# Altium project higgs.PrjPCB (part 1 of 7)
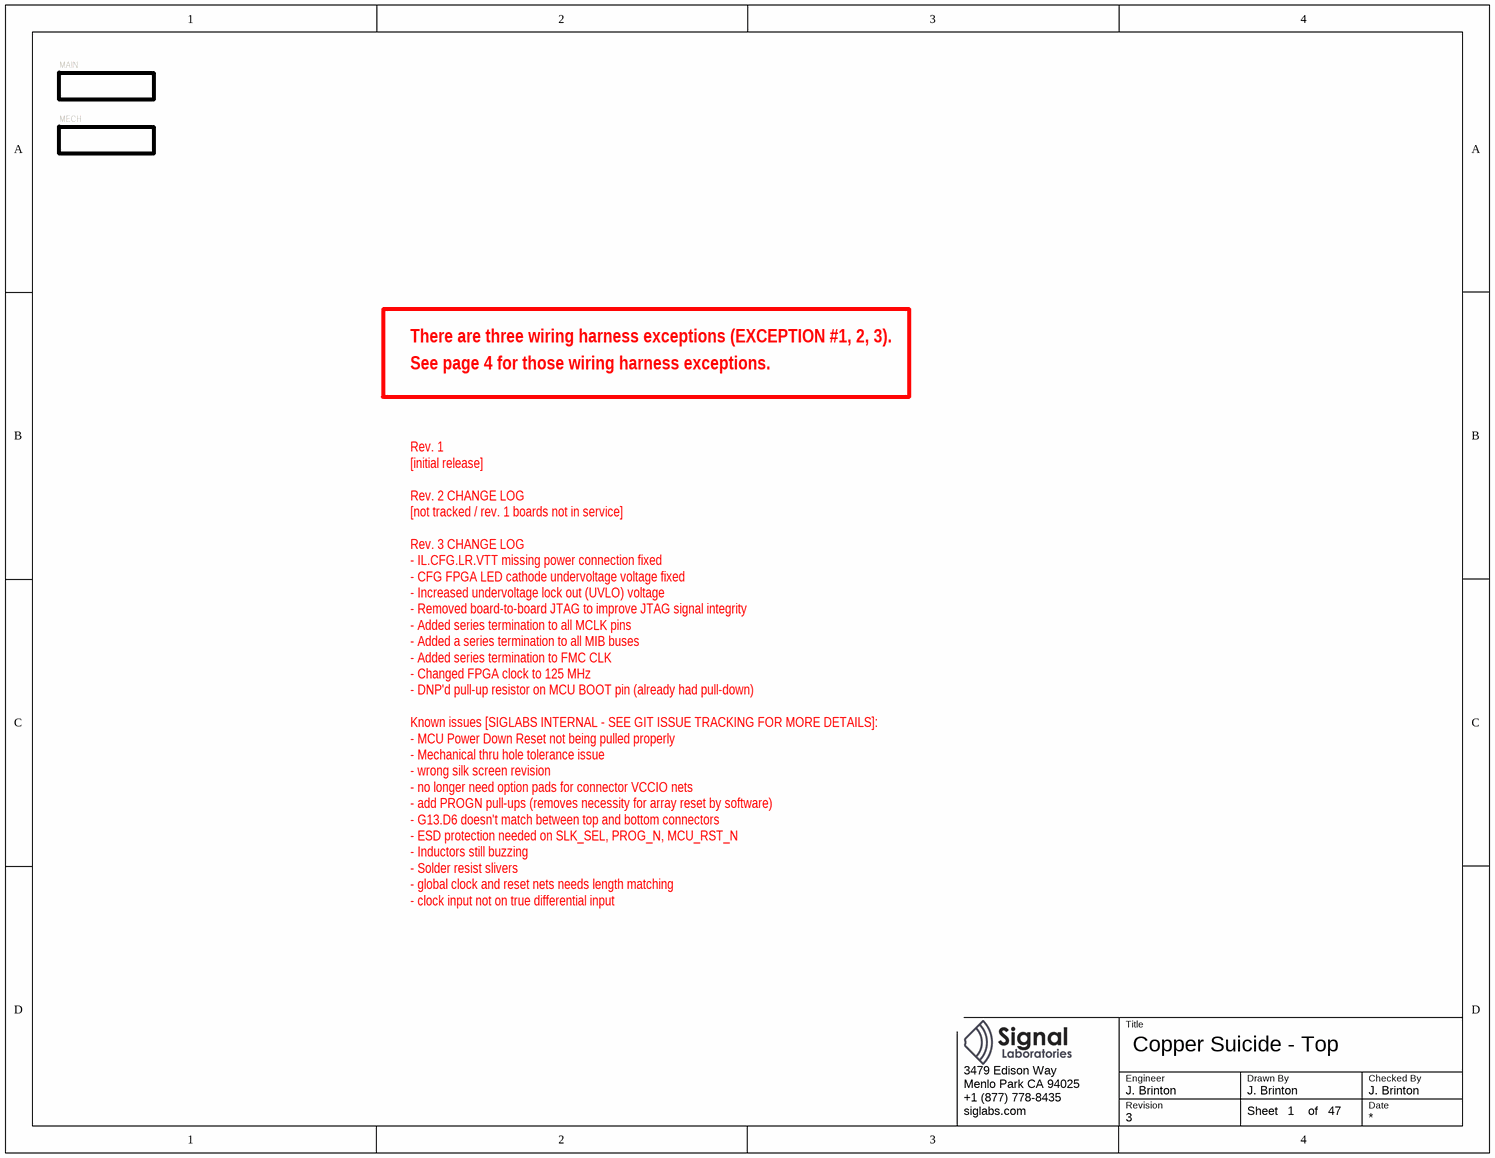
[diagram p0: top.SchDoc]
40 sheets, 1427 parts. Net scope: hierarchical (ports join the sheet entries above them; power ports are global).
Board file: higgs.PcbDoc
Sheets:
  top.SchDoc
    MAIN = main.SchDoc
      ARRAY = array.SchDoc
        FPGA30 = fpga.SchDoc
          FPGA0B = fpga-bank0.SchDoc
          FPGA1B = fpga-bank1.SchDoc
          FPGA2B = fpga-bank2.SchDoc
          FPGA3B = fpga-bank3.SchDoc
          FPGA4B = fpga-bank4.SchDoc
          FPGA6B = fpga-bank6.SchDoc
          FPGA7B = fpga-bank7.SchDoc
          FPGA8B = fpga-bank8.SchDoc
          FPGAGND = fpga-ground.SchDoc
          FPGAMISC = fpga-misc.SchDoc
          FPGASERDES = fpga-serdes.SchDoc
          FPGAPOWER = fpga-power.SchDoc
        FPGA31 = fpga.SchDoc
          FPGA0B = fpga-bank0.SchDoc
          FPGA1B = fpga-bank1.SchDoc
          FPGA2B = fpga-bank2.SchDoc
          FPGA3B = fpga-bank3.SchDoc
          FPGA4B = fpga-bank4.SchDoc
          FPGA6B = fpga-bank6.SchDoc
          FPGA7B = fpga-bank7.SchDoc
          FPGA8B = fpga-bank8.SchDoc
          FPGAGND = fpga-ground.SchDoc
          FPGAMISC = fpga-misc.SchDoc
          FPGASERDES = fpga-serdes.SchDoc
          FPGAPOWER = fpga-power.SchDoc
        FPGA32 = fpga.SchDoc
          FPGA0B = fpga-bank0.SchDoc
          FPGA1B = fpga-bank1.SchDoc
          FPGA2B = fpga-bank2.SchDoc
          FPGA3B = fpga-bank3.SchDoc
          FPGA4B = fpga-bank4.SchDoc
          FPGA6B = fpga-bank6.SchDoc
          FPGA7B = fpga-bank7.SchDoc
          FPGA8B = fpga-bank8.SchDoc
          FPGAGND = fpga-ground.SchDoc
          FPGAMISC = fpga-misc.SchDoc
          FPGASERDES = fpga-serdes.SchDoc
          FPGAPOWER = fpga-power.SchDoc
        FPGA33 = fpga.SchDoc
          FPGA0B = fpga-bank0.SchDoc
          FPGA1B = fpga-bank1.SchDoc
          FPGA2B = fpga-bank2.SchDoc
          FPGA3B = fpga-bank3.SchDoc
          FPGA4B = fpga-bank4.SchDoc
          FPGA6B = fpga-bank6.SchDoc
          FPGA7B = fpga-bank7.SchDoc
          FPGA8B = fpga-bank8.SchDoc
          FPGAGND = fpga-ground.SchDoc
          FPGAMISC = fpga-misc.SchDoc
          FPGASERDES = fpga-serdes.SchDoc
          FPGAPOWER = fpga-power.SchDoc
        FPGA20 = fpga.SchDoc
          FPGA0B = fpga-bank0.SchDoc
          FPGA1B = fpga-bank1.SchDoc
          FPGA2B = fpga-bank2.SchDoc
          FPGA3B = fpga-bank3.SchDoc
          FPGA4B = fpga-bank4.SchDoc
          FPGA6B = fpga-bank6.SchDoc
          FPGA7B = fpga-bank7.SchDoc
          FPGA8B = fpga-bank8.SchDoc
          FPGAGND = fpga-ground.SchDoc
          FPGAMISC = fpga-misc.SchDoc
          FPGASERDES = fpga-serdes.SchDoc
          FPGAPOWER = fpga-power.SchDoc
        FPGA21 = fpga.SchDoc
          FPGA0B = fpga-bank0.SchDoc
          FPGA1B = fpga-bank1.SchDoc
          FPGA2B = fpga-bank2.SchDoc
          FPGA3B = fpga-bank3.SchDoc
          FPGA4B = fpga-bank4.SchDoc
          FPGA6B = fpga-bank6.SchDoc
          FPGA7B = fpga-bank7.SchDoc
          FPGA8B = fpga-bank8.SchDoc
          FPGAGND = fpga-ground.SchDoc
          FPGAMISC = fpga-misc.SchDoc
          FPGASERDES = fpga-serdes.SchDoc
          FPGAPOWER = fpga-power.SchDoc
        FPGA22 = fpga.SchDoc
          FPGA0B = fpga-bank0.SchDoc
          FPGA1B = fpga-bank1.SchDoc
          FPGA2B = fpga-bank2.SchDoc
          FPGA3B = fpga-bank3.SchDoc
          FPGA4B = fpga-bank4.SchDoc
          FPGA6B = fpga-bank6.SchDoc
          FPGA7B = fpga-bank7.SchDoc
          FPGA8B = fpga-bank8.SchDoc
          FPGAGND = fpga-ground.SchDoc
          FPGAMISC = fpga-misc.SchDoc
          FPGASERDES = fpga-serdes.SchDoc
          FPGAPOWER = fpga-power.SchDoc
        FPGA23 = fpga.SchDoc
          FPGA0B = fpga-bank0.SchDoc
          FPGA1B = fpga-bank1.SchDoc
          FPGA2B = fpga-bank2.SchDoc
          FPGA3B = fpga-bank3.SchDoc
          FPGA4B = fpga-bank4.SchDoc
          FPGA6B = fpga-bank6.SchDoc
          FPGA7B = fpga-bank7.SchDoc
          FPGA8B = fpga-bank8.SchDoc
          FPGAGND = fpga-ground.SchDoc
          FPGAMISC = fpga-misc.SchDoc
          FPGASERDES = fpga-serdes.SchDoc
          FPGAPOWER = fpga-power.SchDoc
        TIE-IL12_20-IL68_21 = tie-il12-il68.SchDoc
        TIE-IL12_21-IL68_22 = tie-il12-il68.SchDoc
        TIE-IL12_22-IL68_23 = tie-il12-il68.SchDoc
        TIE-IL12_32-IL68_33 = tie-il12-il68.SchDoc
        TIE-IL12_31-IL68_32 = tie-il12-il68.SchDoc
        TIE-IL12_30-IL68_31 = tie-il12-il68.SchDoc
        SDRAM33 = tie-il34-sdram.SchDoc
          SDRAMU = sdram.SchDoc
          SDRAML = sdram.SchDoc
        SDRAM32 = tie-il34-sdram.SchDoc
          SDRAMU = sdram.SchDoc
          SDRAML = sdram.SchDoc
        SDRAM31 = tie-il34-sdram.SchDoc
          SDRAMU = sdram.SchDoc
          SDRAML = sdram.SchDoc
        SDRAM30 = tie-il34-sdram.SchDoc
          SDRAMU = sdram.SchDoc
          SDRAML = sdram.SchDoc
        TIE-IL34_20-IL07_30 = tie-il34-il07.SchDoc
        TIE-IL34_21-IL07_31 = tie-il34-il07.SchDoc
        TIE-IL34_22-IL07_32 = tie-il34-il07.SchDoc
        TIE-IL34_23-IL07_33 = tie-il34-il07.SchDoc
        CLK = clock.SchDoc
        HARD_RESET = reset.SchDoc
        IMIB = tie-mib-imib.SchDoc
      PWR-V3V3 = power-v3v3.SchDoc
      PWR-V1V35B = power-v1v35.SchDoc
      PWR-VTTR = power-vtt.SchDoc
      PWR-V5 = power-v5.SchDoc
      PWR-V2V5 = power-v2v5.SchDoc
      SOM = som.SchDoc
      con-som = con-som.SchDoc
      cellular = cellular.SchDoc
      U_radio = radio.SchDoc
        U_radio-power = radio-power.SchDoc
        U_radio-interface = radio-interface.SchDoc
        U_radio-rf = radio-rf.SchDoc
          TX = tx.SchDoc
            U_pa-2g = pa-2g.SchDoc
            U_pa-5g = pa-5g.SchDoc
            U_pa-2g = pa-2g.SchDoc
            U_pa-5g = pa-5g.SchDoc
          RX = rx.SchDoc
    MECH = mechanical.SchDoc

## Sheet top.SchDoc: Copper Suicide - Top
size Letter; CheckedBy: J. Brinton; CompanyName: Signal Laboratories, Inc.; DrawnBy: J. Brinton; Engineer: J. Brinton; Address1: 3479 Edison Way; Address2: Menlo Park CA 94025; Address3: +1 (877) 778-8435; Address4: siglabs.com; Revision: 3; SheetNumber: 1; SheetTotal: 47

### Sub-sheets
MAIN = main.SchDoc: no entries
MECH = mechanical.SchDoc: no entries

### Notes on the sheet
- There are three wiring harness exceptions (EXCEPTION #1, 2, 3).
- See page 4 for those wiring harness exceptions.
- Rev. 1
  [initial release]
  Rev. 2 CHANGE LOG
  [not tracked / rev. 1 boards not in service]
  Rev. 3 CHANGE LOG
  - IL.CFG.LR.VTT missing power connection fixed
  - CFG FPGA LED cathode undervoltage voltage fixed
  - Increased undervoltage lock out (UVLO) voltage
  - Removed board-to-board JTAG to improve JTAG signal integrity
  - Added series termination to all MCLK pins
  - Added a series termination to all MIB buses
  - Added series termination to FMC CLK
  - Changed FPGA clock to 125 MHz
  - DNP'd pull-up resistor on MCU BOOT pin (already had pull-down)
  Known issues [SIGLABS INTERNAL - SEE GIT ISSUE TRACKING FOR MORE DETAILS]:
  - MCU Power Down Reset not being pulled properly
  - Mechanical thru hole tolerance issue
  - wrong silk screen revision
  - no longer need option pads for connector VCCIO nets
  - add PROGN pull-ups (removes necessity for array reset by software)
  - G13.D6 doesn't match between top and bottom connectors
  - ESD protection needed on SLK_SEL, PROG_N, MCU_RST_N
  - Inductors still buzzing
  - Solder resist slivers
  - global clock and reset nets needs length matching
  - clock input not on true differential input
- Title
- Engineer
- Revision
- Drawn By
- Checked By
- Date
- Sheet
- of

## Sheet main.SchDoc: CS - Main
size Letter; CheckedBy: J. Brinton; CompanyName: Signal Laboratories, Inc.; DrawnBy: J. Brinton; Engineer: J. Brinton; Address1: 3479 Edison Way; Address2: Menlo Park CA 94025; Address3: +1 (877) 778-8435; Address4: siglabs.com; Revision: 3; SheetNumber: 2; SheetTotal: 47
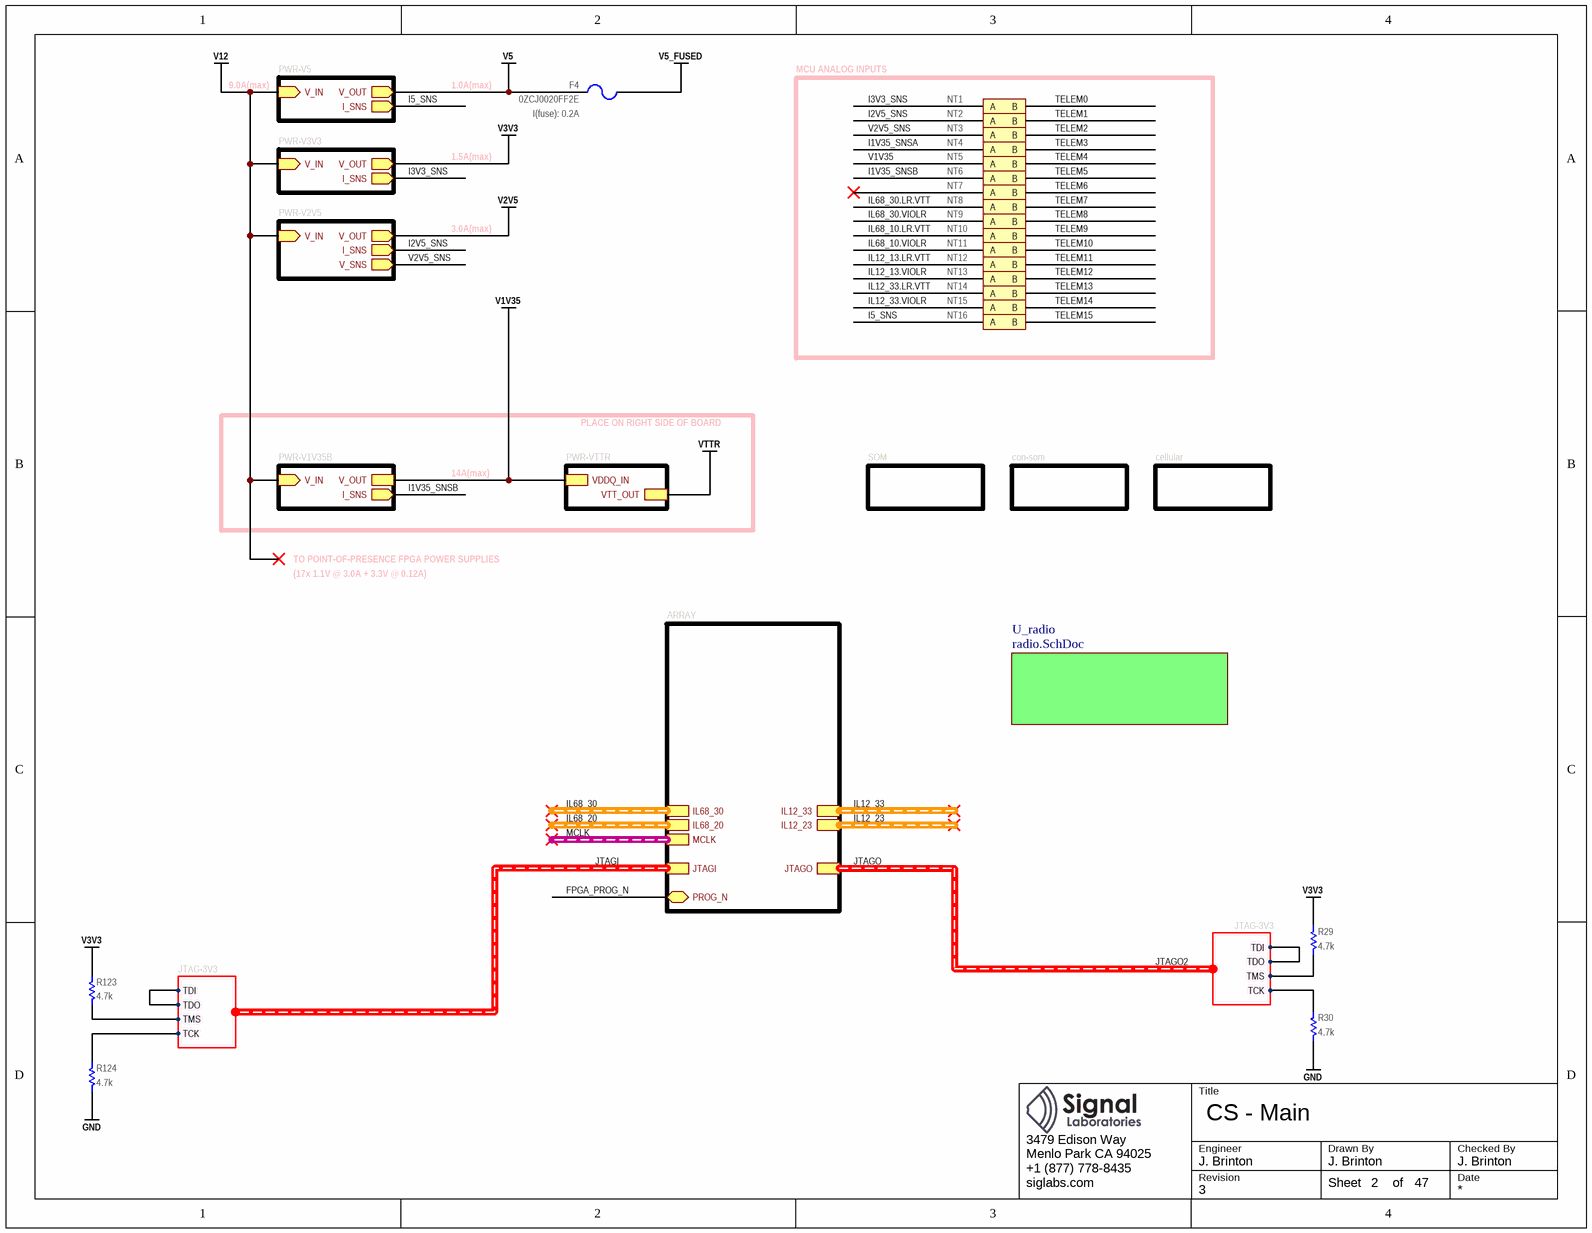
[diagram p1: main.SchDoc]

### Parts
F4  0ZCJ0020FF2E  I(fuse): 0.2A  [1206]
NT1  NET_TIE  [NET_TIE]  (value not drawn)  (net tie, no BOM)
NT2  NET_TIE  [NET_TIE]  (value not drawn)  (net tie, no BOM)
NT3  NET_TIE  [NET_TIE]  (value not drawn)  (net tie, no BOM)
NT4  NET_TIE  [NET_TIE]  (value not drawn)  (net tie, no BOM)
NT5  NET_TIE  [NET_TIE]  (value not drawn)  (net tie, no BOM)
NT6  NET_TIE  [NET_TIE]  (value not drawn)  (net tie, no BOM)
NT7  NET_TIE  [NET_TIE]  (value not drawn)  (net tie, no BOM)
NT8  NET_TIE  [NET_TIE]  (value not drawn)  (net tie, no BOM)
NT9  NET_TIE  [NET_TIE]  (value not drawn)  (net tie, no BOM)
NT10  NET_TIE  [NET_TIE]  (value not drawn)  (net tie, no BOM)
NT11  NET_TIE  [NET_TIE]  (value not drawn)  (net tie, no BOM)
NT12  NET_TIE  [NET_TIE]  (value not drawn)  (net tie, no BOM)
NT13  NET_TIE  [NET_TIE]  (value not drawn)  (net tie, no BOM)
NT14  NET_TIE  [NET_TIE]  (value not drawn)  (net tie, no BOM)
NT15  NET_TIE  [NET_TIE]  (value not drawn)  (net tie, no BOM)
NT16  NET_TIE  [NET_TIE]  (value not drawn)  (net tie, no BOM)
R29  value 4.7k  [RESC1005X40N]  (hidden comment: ERJ-2RKF4701X)
R30  value 4.7k  [RESC1005X40N]  (hidden comment: ERJ-2RKF4701X)
R123  value 4.7k  [RESC1005X40N]  (hidden comment: ERJ-2RKF4701X)
R124  value 4.7k  [RESC1005X40N]  (hidden comment: ERJ-2RKF4701X)

### Blocks framed on the sheet
MCU ANALOG INPUTS: NT1-NT16

### Sub-sheets
ARRAY = array.SchDoc: IL68_20 (harness IL), IL68_30 (harness IL), IL12_33 (harness IL), IL12_23 (harness IL), MCLK (harness LVPECL33), JTAGI (harness JTAG-3V3), JTAGO (harness JTAG-3V3), PROG_N (bidir)
cellular = cellular.SchDoc: no entries
con-som = con-som.SchDoc: no entries
PWR-V1V35B = power-v1v35.SchDoc: I_SNS (out), V_OUT, V_IN (in)
PWR-V2V5 = power-v2v5.SchDoc: I_SNS (out), V_SNS (out), V_IN (in), V_OUT (out)
PWR-V3V3 = power-v3v3.SchDoc: I_SNS (out), V_IN (in), V_OUT (out)
PWR-V5 = power-v5.SchDoc: V_IN (in), V_OUT (out), I_SNS (out)
PWR-VTTR = power-vtt.SchDoc: VTT_OUT, VDDQ_IN
SOM = som.SchDoc: no entries
U_radio = radio.SchDoc: no entries

### Harnesses
JTAG-3V3: TMS, TCK, TDI, TDO

### Nets
GND: R30.1 R124.1
V1V35: NT5.A ; sheet PWR-V1V35B/V_OUT, sheet PWR-VTTR/VDDQ_IN
V3V3: R29.2 R123.2 ; sheet PWR-V3V3/V_OUT
V5: F4.1 ; sheet PWR-V5/V_OUT
V5_FUSED: F4.2
V12: sheet PWR-V3V3/V_IN, sheet PWR-V1V35B/V_IN, sheet PWR-V5/V_IN, sheet PWR-V2V5/V_IN
I1V35_SNSA: NT4.A
I1V35_SNSB: NT6.A ; sheet PWR-V1V35B/I_SNS
I2V5_SNS: NT2.A ; sheet PWR-V2V5/I_SNS
I3V3_SNS: NT1.A ; sheet PWR-V3V3/I_SNS
I5_SNS: NT16.A ; sheet PWR-V5/I_SNS
IL12_13.LR.VTT: NT12.A
IL12_13.VIOLR: NT13.A
IL12_33.LR.VTT: NT14.A
IL12_33.VIOLR: NT15.A
IL68_10.LR.VTT: NT10.A
IL68_10.VIOLR: NT11.A
IL68_30.LR.VTT: NT8.A
IL68_30.VIOLR: NT9.A
JTAG_33.TCK: R30.2 ; sheet ARRAY/JTAGO.TCK
JTAG_33.TDI: sheet ARRAY/JTAGO.TDI, sheet ARRAY/JTAGO.TDO
JTAG_33.TMS: R29.1 ; sheet ARRAY/JTAGO.TMS
JTAGI.TCK: R124.2 ; sheet ARRAY/JTAGI.TCK
JTAGI.TDI: sheet ARRAY/JTAGI.TDI, sheet ARRAY/JTAGI.TDO
JTAGI.TMS: R123.1 ; sheet ARRAY/JTAGI.TMS
TELEM0: NT1.B
TELEM1: NT2.B
TELEM2: NT3.B
TELEM3: NT4.B
TELEM4: NT5.B
TELEM5: NT6.B
TELEM6: NT7.B
TELEM7: NT8.B
TELEM8: NT9.B
TELEM9: NT10.B
TELEM10: NT11.B
TELEM11: NT12.B
TELEM12: NT13.B
TELEM13: NT14.B
TELEM14: NT15.B
TELEM15: NT16.B
V2V5_SNS: NT3.A ; sheet PWR-V2V5/V_SNS

Not connected (* = marked no-connect by the designer): NT7 A*

### Buses and harness runs
harness IL12_23 = sheet ARRAY/IL12_23
harness IL12_33 = sheet ARRAY/IL12_33
harness IL68_20 = sheet ARRAY/IL68_20
harness IL68_30 = sheet ARRAY/IL68_30
harness JTAGI = sheet ARRAY/JTAGI
harness JTAGO = JTAGO2 = sheet ARRAY/JTAGO
harness MCLK = sheet ARRAY/MCLK

### Notes on the sheet
- 9.0A(max)
- 1.0A(max)
- 1.5A(max)
- 3.0A(max)
- PLACE ON RIGHT SIDE OF BOARD
- 14A(max)
- TO POINT-OF-PRESENCE FPGA POWER SUPPLIES
- (17x 1.1V @ 3.0A + 3.3V @ 0.12A)
- Title
- Engineer
- Revision
- Drawn By
- Checked By
- Date
- Sheet
- of

### Library data of the parts
F4 = 0ZCJ0020FF2E: PTC Resettable Fuse, 0.2A, 30V, SMD 1206; Manufacturer: Bell Fuse; Manufacturer P/N: 0ZCJ0020FF2E
R29 R30 R123 R124 = RES: Thick Film Resistor 4.7k ±1% 0.1W 75V 0402; Manufacturer: Panasonic; Tcr: ±100; Tr: -55:155; Voltage: 75; Power: 0.1; Tolerance: ±1%; Manufacturer P/N: ERJ-2RKF4701X; Alternatives: *; Footprint: *; Package: 0402

## Sheet array.SchDoc: CS - Array
size Letter; CheckedBy: J. Brinton; CompanyName: Signal Laboratories, Inc.; DrawnBy: J. Brinton; Engineer: J. Brinton; Address1: 3479 Edison Way; Address2: Menlo Park CA 94025; Address3: +1 (877) 778-8435; Address4: siglabs.com; Revision: 3; SheetNumber: 3; SheetTotal: 47
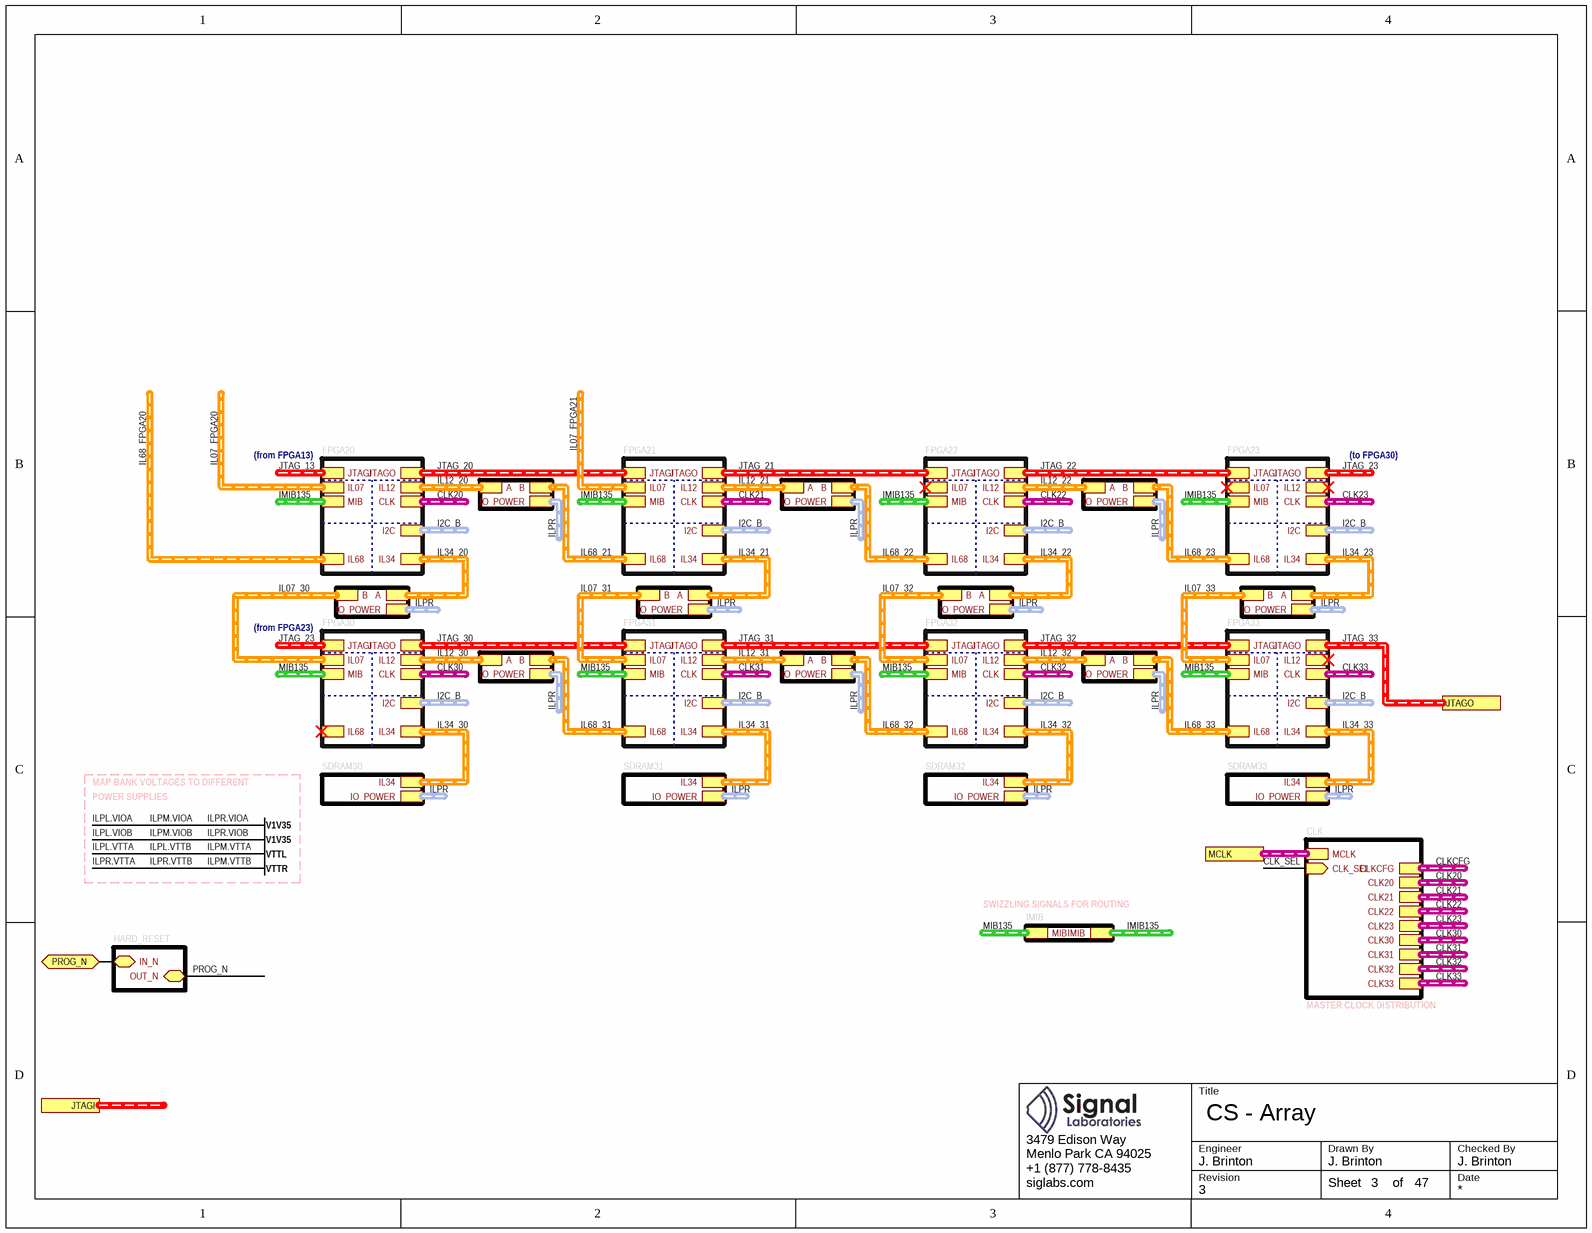
[diagram p2: array.SchDoc]

### Sub-sheets
CLK = clock.SchDoc: MCLK (harness LVPECL33), CLK20 (harness LVPECL33), CLK21 (harness LVPECL33), CLK22 (harness LVPECL33), CLK23 (harness LVPECL33), CLK30 (harness LVPECL33), CLK31 (harness LVPECL33), CLK32 (harness LVPECL33), CLK33 (harness LVPECL33), CLKCFG (harness LVPECL33), CLK_SEL (in)
FPGA20 = fpga.SchDoc: MIB (harness MIB), JTAGI (harness JTAG-3V3), JTAGO (harness JTAG-3V3), IL07 (harness IL), IL68 (harness IL), IL12 (harness IL), CLK (harness LVPECL33), IL34 (harness IL), I2C (harness I2C-3V3)
FPGA21 = fpga.SchDoc: MIB (harness MIB), JTAGI (harness JTAG-3V3), JTAGO (harness JTAG-3V3), IL07 (harness IL), IL68 (harness IL), IL12 (harness IL), CLK (harness LVPECL33), IL34 (harness IL), I2C (harness I2C-3V3)
FPGA22 = fpga.SchDoc: MIB (harness MIB), JTAGI (harness JTAG-3V3), JTAGO (harness JTAG-3V3), IL07 (harness IL), IL68 (harness IL), IL12 (harness IL), CLK (harness LVPECL33), IL34 (harness IL), I2C (harness I2C-3V3)
FPGA23 = fpga.SchDoc: MIB (harness MIB), JTAGI (harness JTAG-3V3), JTAGO (harness JTAG-3V3), IL07 (harness IL), IL68 (harness IL), IL12 (harness IL), CLK (harness LVPECL33), IL34 (harness IL), I2C (harness I2C-3V3)
FPGA30 = fpga.SchDoc: MIB (harness MIB), JTAGI (harness JTAG-3V3), JTAGO (harness JTAG-3V3), IL07 (harness IL), IL68 (harness IL), IL12 (harness IL), CLK (harness LVPECL33), IL34 (harness IL), I2C (harness I2C-3V3)
FPGA31 = fpga.SchDoc: MIB (harness MIB), JTAGI (harness JTAG-3V3), JTAGO (harness JTAG-3V3), IL07 (harness IL), IL68 (harness IL), IL12 (harness IL), CLK (harness LVPECL33), IL34 (harness IL), I2C (harness I2C-3V3)
FPGA32 = fpga.SchDoc: MIB (harness MIB), JTAGI (harness JTAG-3V3), JTAGO (harness JTAG-3V3), IL07 (harness IL), IL68 (harness IL), IL12 (harness IL), CLK (harness LVPECL33), IL34 (harness IL), I2C (harness I2C-3V3)
FPGA33 = fpga.SchDoc: MIB (harness MIB), JTAGI (harness JTAG-3V3), JTAGO (harness JTAG-3V3), IL07 (harness IL), IL68 (harness IL), IL12 (harness IL), CLK (harness LVPECL33), IL34 (harness IL), I2C (harness I2C-3V3)
HARD_RESET = reset.SchDoc: OUT_N (bidir), IN_N (bidir)
IMIB = tie-mib-imib.SchDoc: MIB (harness MIB), IMIB (harness MIB)
SDRAM30 = tie-il34-sdram.SchDoc: IL34 (harness IL), IO_POWER (harness ILP)
SDRAM31 = tie-il34-sdram.SchDoc: IL34 (harness IL), IO_POWER (harness ILP)
SDRAM32 = tie-il34-sdram.SchDoc: IL34 (harness IL), IO_POWER (harness ILP)
SDRAM33 = tie-il34-sdram.SchDoc: IL34 (harness IL), IO_POWER (harness ILP)
TIE-IL12_20-IL68_21 = tie-il12-il68.SchDoc: A (harness IL), B (harness IL), IO_POWER (harness ILP)
TIE-IL12_21-IL68_22 = tie-il12-il68.SchDoc: A (harness IL), B (harness IL), IO_POWER (harness ILP)
TIE-IL12_22-IL68_23 = tie-il12-il68.SchDoc: A (harness IL), B (harness IL), IO_POWER (harness ILP)
TIE-IL12_30-IL68_31 = tie-il12-il68.SchDoc: A (harness IL), B (harness IL), IO_POWER (harness ILP)
TIE-IL12_31-IL68_32 = tie-il12-il68.SchDoc: A (harness IL), B (harness IL), IO_POWER (harness ILP)
TIE-IL12_32-IL68_33 = tie-il12-il68.SchDoc: A (harness IL), B (harness IL), IO_POWER (harness ILP)
TIE-IL34_20-IL07_30 = tie-il34-il07.SchDoc: B (harness IL), A (harness IL), IO_POWER (harness ILP)
TIE-IL34_21-IL07_31 = tie-il34-il07.SchDoc: B (harness IL), A (harness IL), IO_POWER (harness ILP)
TIE-IL34_22-IL07_32 = tie-il34-il07.SchDoc: B (harness IL), A (harness IL), IO_POWER (harness ILP)
TIE-IL34_23-IL07_33 = tie-il34-il07.SchDoc: B (harness IL), A (harness IL), IO_POWER (harness ILP)

### Ports
JTAGI (harness JTAG-3V3), JTAGO (harness JTAG-3V3), MCLK (harness LVPECL33), PROG_N (bidir)

### Nets
FPGA_PROG_N: port PROG_N, sheet HARD_RESET/IN_N

### Buses and harness runs
harness CLK20 = sheet CLK/CLK20
harness CLK20 = sheet FPGA20/CLK
harness CLK21 = sheet CLK/CLK21
harness CLK21 = sheet FPGA21/CLK
harness CLK22 = sheet CLK/CLK22
harness CLK22 = sheet FPGA22/CLK
harness CLK23 = sheet CLK/CLK23
harness CLK23 = sheet FPGA23/CLK
harness CLK30 = sheet CLK/CLK30
harness CLK30 = sheet FPGA30/CLK
harness CLK31 = sheet CLK/CLK31
harness CLK31 = sheet FPGA31/CLK
harness CLK32 = sheet CLK/CLK32
harness CLK32 = sheet FPGA32/CLK
harness CLK33 = sheet CLK/CLK33
harness CLK33 = sheet FPGA33/CLK
harness CLKCFG = sheet CLK/CLKCFG
harness I2C_B = sheet FPGA20/I2C
harness I2C_B = sheet FPGA21/I2C
harness I2C_B = sheet FPGA22/I2C
harness I2C_B = sheet FPGA23/I2C
harness I2C_B = sheet FPGA30/I2C
harness I2C_B = sheet FPGA31/I2C
harness I2C_B = sheet FPGA32/I2C
harness I2C_B = sheet FPGA33/I2C
harness IL07_30 = sheet FPGA30/IL07 = sheet TIE-IL34_20-IL07_30/B
harness IL07_31 = sheet FPGA31/IL07 = sheet TIE-IL34_21-IL07_31/B
harness IL07_32 = sheet FPGA32/IL07 = sheet TIE-IL34_22-IL07_32/B
harness IL07_33 = sheet FPGA33/IL07 = sheet TIE-IL34_23-IL07_33/B
harness IL07_FPGA20 = sheet FPGA20/IL07
harness IL07_FPGA21 = sheet FPGA21/IL07
harness IL12_20 = sheet FPGA20/IL12 = sheet TIE-IL12_20-IL68_21/A
harness IL12_21 = sheet FPGA21/IL12 = sheet TIE-IL12_21-IL68_22/A
harness IL12_22 = sheet FPGA22/IL12 = sheet TIE-IL12_22-IL68_23/A
harness IL12_30 = sheet FPGA30/IL12 = sheet TIE-IL12_30-IL68_31/A
harness IL12_31 = sheet FPGA31/IL12 = sheet TIE-IL12_31-IL68_32/A
harness IL12_32 = sheet FPGA32/IL12 = sheet TIE-IL12_32-IL68_33/A
harness IL34_20 = sheet FPGA20/IL34 = sheet TIE-IL34_20-IL07_30/A
harness IL34_21 = sheet FPGA21/IL34 = sheet TIE-IL34_21-IL07_31/A
harness IL34_22 = sheet FPGA22/IL34 = sheet TIE-IL34_22-IL07_32/A
harness IL34_23 = sheet FPGA23/IL34 = sheet TIE-IL34_23-IL07_33/A
harness IL34_30 = sheet FPGA30/IL34 = sheet SDRAM30/IL34
harness IL34_31 = sheet FPGA31/IL34 = sheet SDRAM31/IL34
harness IL34_32 = sheet FPGA32/IL34 = sheet SDRAM32/IL34
harness IL34_33 = sheet FPGA33/IL34 = sheet SDRAM33/IL34
harness IL68_21 = sheet FPGA21/IL68 = sheet TIE-IL12_20-IL68_21/B
harness IL68_22 = sheet FPGA22/IL68 = sheet TIE-IL12_21-IL68_22/B
harness IL68_23 = sheet FPGA23/IL68 = sheet TIE-IL12_22-IL68_23/B
harness IL68_31 = sheet FPGA31/IL68 = sheet TIE-IL12_30-IL68_31/B
harness IL68_32 = sheet FPGA32/IL68 = sheet TIE-IL12_31-IL68_32/B
harness IL68_33 = sheet FPGA33/IL68 = sheet TIE-IL12_32-IL68_33/B
harness IL68_FPGA20 = sheet FPGA20/IL68
harness ILPR = sheet SDRAM30/IO_POWER
harness ILPR = sheet SDRAM31/IO_POWER
harness ILPR = sheet SDRAM32/IO_POWER
harness ILPR = sheet SDRAM33/IO_POWER
harness ILPR = sheet TIE-IL12_20-IL68_21/IO_POWER
harness ILPR = sheet TIE-IL12_21-IL68_22/IO_POWER
harness ILPR = sheet TIE-IL12_22-IL68_23/IO_POWER
harness ILPR = sheet TIE-IL12_30-IL68_31/IO_POWER
harness ILPR = sheet TIE-IL12_31-IL68_32/IO_POWER
harness ILPR = sheet TIE-IL12_32-IL68_33/IO_POWER
harness ILPR = sheet TIE-IL34_20-IL07_30/IO_POWER
harness ILPR = sheet TIE-IL34_21-IL07_31/IO_POWER
harness ILPR = sheet TIE-IL34_22-IL07_32/IO_POWER
harness ILPR = sheet TIE-IL34_23-IL07_33/IO_POWER
harness IMIB135 = sheet FPGA20/MIB
harness IMIB135 = sheet FPGA21/MIB
harness IMIB135 = sheet FPGA22/MIB
harness IMIB135 = sheet FPGA23/MIB
harness IMIB135 = sheet IMIB/IMIB
harness JTAG_13 = sheet FPGA20/JTAGI
harness JTAG_20 = sheet FPGA20/JTAGO = sheet FPGA21/JTAGI
harness JTAG_21 = sheet FPGA21/JTAGO = sheet FPGA22/JTAGI
harness JTAG_22 = sheet FPGA22/JTAGO = sheet FPGA23/JTAGI
harness JTAG_23 = sheet FPGA23/JTAGO
harness JTAG_23 = sheet FPGA30/JTAGI
harness JTAG_30 = sheet FPGA30/JTAGO = sheet FPGA31/JTAGI
harness JTAG_31 = sheet FPGA31/JTAGO = sheet FPGA32/JTAGI
harness JTAG_32 = sheet FPGA32/JTAGO = sheet FPGA33/JTAGI
harness JTAG_33 = port JTAGO = sheet FPGA33/JTAGO
harness MIB135 = sheet FPGA30/MIB
harness MIB135 = sheet FPGA31/MIB
harness MIB135 = sheet FPGA32/MIB
harness MIB135 = sheet FPGA33/MIB
harness MIB135 = sheet IMIB/MIB
harness port MCLK = sheet CLK/MCLK

### Notes on the sheet
- (from FPGA13)
- (to FPGA30)
- (from FPGA23)
- POWER SUPPLIES
- MAP BANK VOLTAGES TO DIFFERENT
- SWIZZLING SIGNALS FOR ROUTING
- MASTER CLOCK DISTRIBUTION
- Title
- Engineer
- Revision
- Drawn By
- Checked By
- Date
- Sheet
- of

## Sheet fpga.SchDoc: CS - FPGA
size Letter; CheckedBy: J. Brinton; CompanyName: Signal Laboratories, Inc.; DrawnBy: J. Brinton; Engineer: J. Brinton; Address1: 3479 Edison Way; Address2: Menlo Park CA 94025; Address3: +1 (877) 778-8435; Address4: siglabs.com; Revision: 3; SheetNumber: 4; SheetTotal: 47
Used 8 times, as channels MAIN/ARRAY/FPGA30, MAIN/ARRAY/FPGA31, MAIN/ARRAY/FPGA32, MAIN/ARRAY/FPGA33, MAIN/ARRAY/FPGA20, MAIN/ARRAY/FPGA21, MAIN/ARRAY/FPGA22, MAIN/ARRAY/FPGA23. Parts and nets are listed once, with the designators drawn on the sheet.
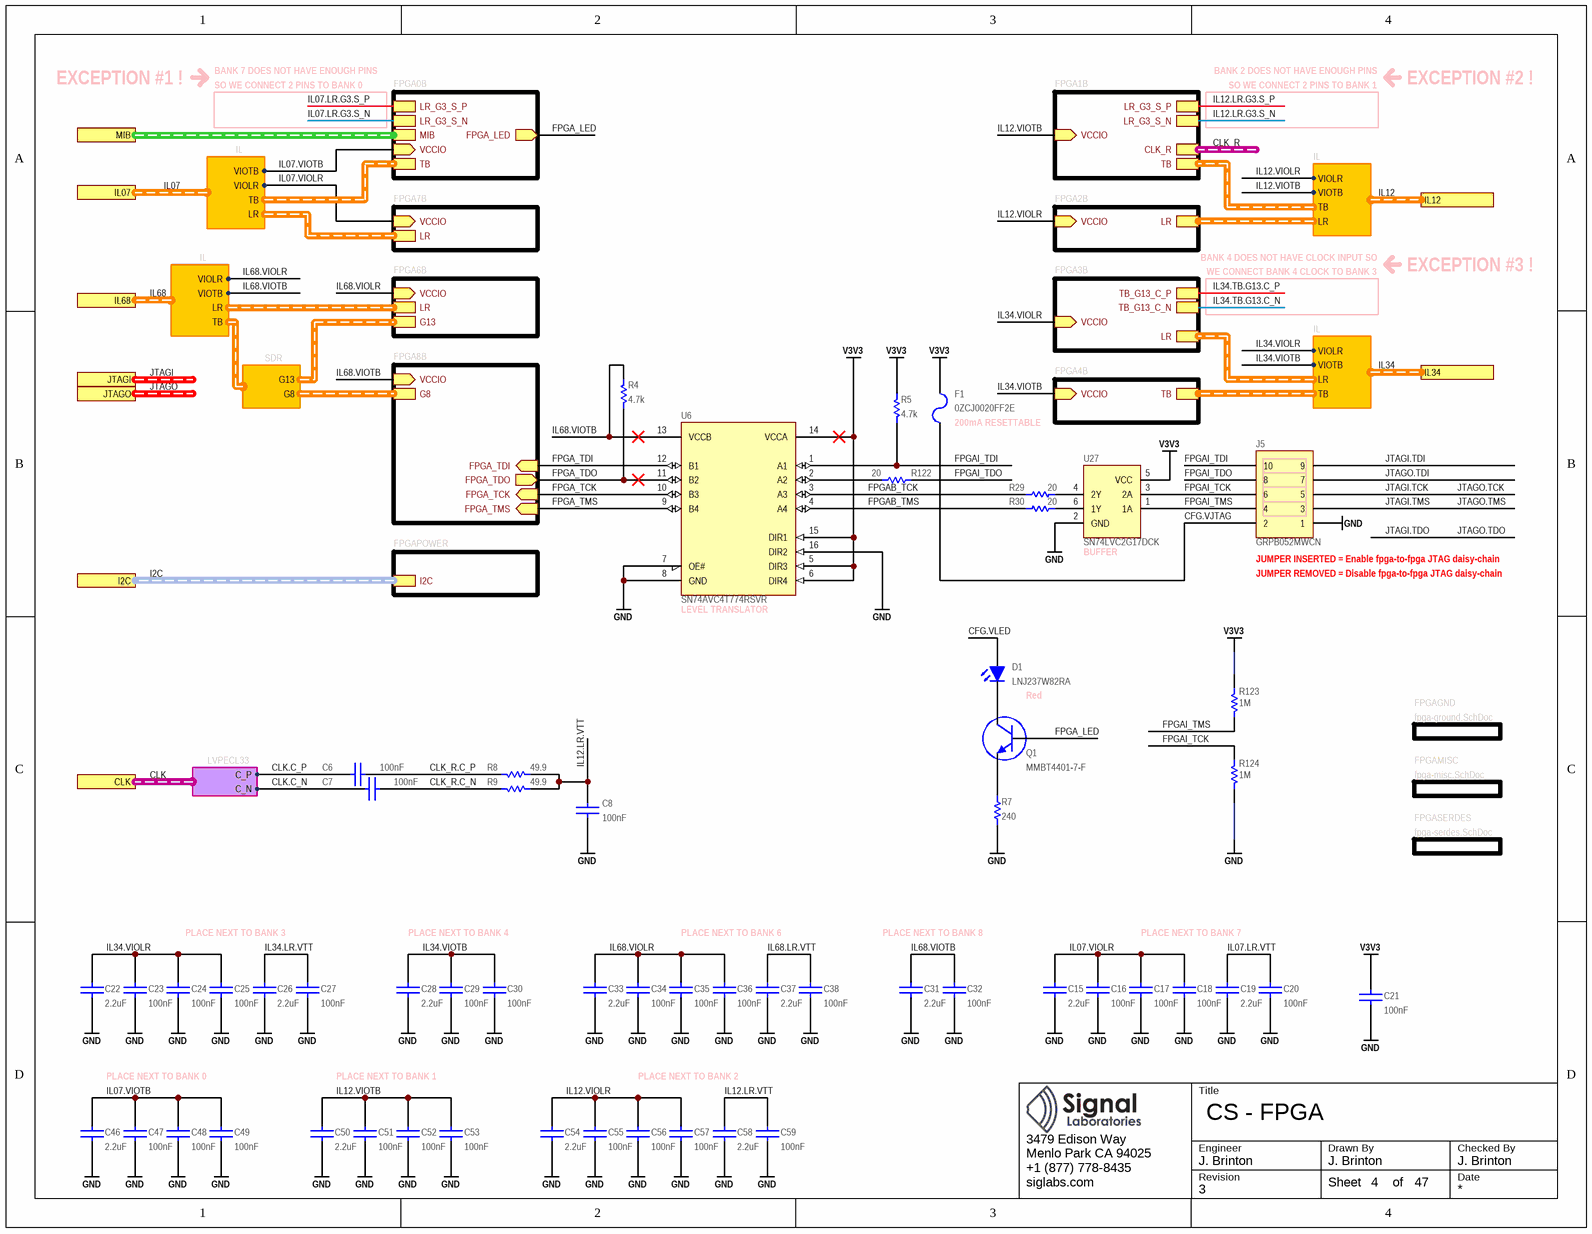
[diagram p3: fpga.SchDoc]

### Parts
C6  value 100nF  [CAPC100X50X55L25N]  (hidden comment: GCM155R71H104KE02)
C7  value 100nF  [CAPC100X50X55L25N]  (hidden comment: GCM155R71H104KE02)
C8  value 100nF  [CAPC100X50X55L25N]  (hidden comment: GCM155R71H104KE02)
C15  value 2.2uF  [CAPC160X80X90L20N]  (hidden comment: C1608X7R1A225M080)
C16  value 100nF  [CAPC100X50X55L25N]  (hidden comment: GCM155R71H104KE02)
C17  value 100nF  [CAPC100X50X55L25N]  (hidden comment: GCM155R71H104KE02)
C18  value 100nF  [CAPC100X50X55L25N]  (hidden comment: GCM155R71H104KE02)
C19  value 2.2uF  [CAPC160X80X90L20N]  (hidden comment: C1608X7R1A225M080)
C20  value 100nF  [CAPC100X50X55L25N]  (hidden comment: GCM155R71H104KE02)
C21  value 100nF  [CAPC100X50X55L25N]  (hidden comment: GCM155R71H104KE02)
C22  value 2.2uF  [CAPC160X80X90L20N]  (hidden comment: C1608X7R1A225M080)
C23  value 100nF  [CAPC100X50X55L25N]  (hidden comment: GCM155R71H104KE02)
C24  value 100nF  [CAPC100X50X55L25N]  (hidden comment: GCM155R71H104KE02)
C25  value 100nF  [CAPC100X50X55L25N]  (hidden comment: GCM155R71H104KE02)
C26  value 2.2uF  [CAPC160X80X90L20N]  (hidden comment: C1608X7R1A225M080)
C27  value 100nF  [CAPC100X50X55L25N]  (hidden comment: GCM155R71H104KE02)
C28  value 2.2uF  [CAPC160X80X90L20N]  (hidden comment: C1608X7R1A225M080)
C29  value 100nF  [CAPC100X50X55L25N]  (hidden comment: GCM155R71H104KE02)
C30  value 100nF  [CAPC100X50X55L25N]  (hidden comment: GCM155R71H104KE02)
C31  value 2.2uF  [CAPC160X80X90L20N]  (hidden comment: C1608X7R1A225M080)
C32  value 100nF  [CAPC100X50X55L25N]  (hidden comment: GCM155R71H104KE02)
C33  value 2.2uF  [CAPC160X80X90L20N]  (hidden comment: C1608X7R1A225M080)
C34  value 100nF  [CAPC100X50X55L25N]  (hidden comment: GCM155R71H104KE02)
C35  value 100nF  [CAPC100X50X55L25N]  (hidden comment: GCM155R71H104KE02)
C36  value 100nF  [CAPC100X50X55L25N]  (hidden comment: GCM155R71H104KE02)
C37  value 2.2uF  [CAPC160X80X90L20N]  (hidden comment: C1608X7R1A225M080)
C38  value 100nF  [CAPC100X50X55L25N]  (hidden comment: GCM155R71H104KE02)
C46  value 2.2uF  [CAPC160X80X90L20N]  (hidden comment: C1608X7R1A225M080)
C47  value 100nF  [CAPC100X50X55L25N]  (hidden comment: GCM155R71H104KE02)
C48  value 100nF  [CAPC100X50X55L25N]  (hidden comment: GCM155R71H104KE02)
C49  value 100nF  [CAPC100X50X55L25N]  (hidden comment: GCM155R71H104KE02)
C50  value 2.2uF  [CAPC160X80X90L20N]  (hidden comment: C1608X7R1A225M080)
C51  value 100nF  [CAPC100X50X55L25N]  (hidden comment: GCM155R71H104KE02)
C52  value 100nF  [CAPC100X50X55L25N]  (hidden comment: GCM155R71H104KE02)
C53  value 100nF  [CAPC100X50X55L25N]  (hidden comment: GCM155R71H104KE02)
C54  value 2.2uF  [CAPC160X80X90L20N]  (hidden comment: C1608X7R1A225M080)
C55  value 100nF  [CAPC100X50X55L25N]  (hidden comment: GCM155R71H104KE02)
C56  value 100nF  [CAPC100X50X55L25N]  (hidden comment: GCM155R71H104KE02)
C57  value 100nF  [CAPC100X50X55L25N]  (hidden comment: GCM155R71H104KE02)
C58  value 2.2uF  [CAPC160X80X90L20N]  (hidden comment: C1608X7R1A225M080)
C59  value 100nF  [CAPC100X50X55L25N]  (hidden comment: GCM155R71H104KE02)
D1  LNJ237W82RA  [0603_LED]
F1  0ZCJ0020FF2E  [1206]
J5  GRPB052MWCN  [GRPB052MWCN]
Q1  MMBT4401-7-F  [SOT23]
R4  value 4.7k  [RESC1005X40N]  (hidden comment: ERJ-2RKF4701X)
R5  value 4.7k  [RESC1005X40N]  (hidden comment: ERJ-2RKF4701X)
R7  value 240  [RESC1005X40N]  (hidden comment: ERJ-2RKF2400X)
R8  value 49.9  [RESC1005X40N]  (hidden comment: ERJ-2RKF49R9X)
R9  value 49.9  [RESC1005X40N]  (hidden comment: ERJ-2RKF49R9X)
R29  value 20  [RESC1005X40N]  (hidden comment: ERJ-2RKF20R0X)
R30  value 20  [RESC1005X40N]  (hidden comment: ERJ-2RKF20R0X)
R122  value 20  [RESC1005X40N]  (hidden comment: ERJ-2RKF20R0X)
R123  value 1M  [RESC1005X40N]  (hidden comment: ERJ-2RKF1004X)
R124  value 1M  [RESC1005X40N]  (hidden comment: ERJ-2RKF1004X)
U6  SN74AVC4T774RSVR  [RSV]
U27  SN74LVC2G17DCK  [DCK-6]

### Sub-sheets
FPGA0B = fpga-bank0.SchDoc: MIB (harness MIB), TB (harness SDR), VCCIO (in), FPGA_LED (out), LR_G3_S_N, LR_G3_S_P
FPGA1B = fpga-bank1.SchDoc: TB (harness SDR), VCCIO (in), CLK_R (harness LVPECL33), LR_G3_S_N, LR_G3_S_P
FPGA2B = fpga-bank2.SchDoc: LR (harness DDR), VCCIO (in)
FPGA3B = fpga-bank3.SchDoc: LR (harness DDR), TB_G13_C_P, TB_G13_C_N, VCCIO (in)
FPGA4B = fpga-bank4.SchDoc: TB (harness SDR), VCCIO (in)
FPGA6B = fpga-bank6.SchDoc: LR (harness DDR), G13 (harness GPIO13), VCCIO (in)
FPGA7B = fpga-bank7.SchDoc: LR (harness DDR), VCCIO (in)
FPGA8B = fpga-bank8.SchDoc: G8 (harness GPIO8), FPGA_TDO (out), FPGA_TDI (in), FPGA_TMS (in), FPGA_TCK (in), VCCIO (in)
FPGAGND = fpga-ground.SchDoc: no entries
FPGAMISC = fpga-misc.SchDoc: no entries
FPGAPOWER = fpga-power.SchDoc: I2C (harness I2C-3V3)
FPGASERDES = fpga-serdes.SchDoc: no entries

### Ports
CLK (harness LVPECL33), I2C (harness I2C-3V3), IL07 (harness IL), IL12 (harness IL), IL34 (harness IL), IL68 (harness IL), JTAGI (harness JTAG-3V3), JTAGO (harness JTAG-3V3), MIB (harness MIB)

### Harnesses
IL: LR, TB, VIOLR, VIOTB
SDR: G13, G8
IL: TB, LR, VIOLR, VIOTB
LVPECL33: C_P, C_N

### Nets
GND: C8.1 C15.1 C16.1 C17.1 C18.1 C19.1 C20.1 C21.1 C22.1 C23.1 C24.1 C25.1 C26.1 C27.1 C28.1 C29.1 C30.1 C31.1 C32.1 C33.1 C34.1 C35.1 C36.1 C37.1 C38.1 C46.1 C47.1 C48.1 C49.1 C50.1 C51.1 C52.1 C53.1 C54.1 C55.1 C56.1 C57.1 C58.1 C59.1 J5.1 R7.2 R124.2 U6.7(OE#) U6.8(GND) U6.16(DIR2) U27.2(GND)
V3V3: C21.2 F1.1 R5.2 R123.1 U6.5(DIR3) U6.6(DIR4) U6.14(VCCA) U6.15(DIR1) U27.5(VCC)
CFG.VJTAG: F1.2 J5.2
CFG.VLED: D1.1(A)
CLK.C_N: C7.2 ; port CLK.C_N
CLK.C_P: C6.2 ; port CLK.C_P
CLK_R.C_N: C7.1 R9.2
CLK_R.C_P: C6.1 R8.2
FPGA_LED: Q1.1(B) ; sheet FPGA0B/FPGA_LED
FPGA_TCK: U6.10(B3) ; sheet FPGA8B/FPGA_TCK
FPGA_TDI: U6.12(B1) ; sheet FPGA8B/FPGA_TDI
FPGA_TDO: R4.1 U6.11(B2) ; sheet FPGA8B/FPGA_TDO
FPGA_TMS: U6.9(B4) ; sheet FPGA8B/FPGA_TMS
FPGAB_TCK: R29.1 U6.3(A3)
FPGAB_TMS: R30.1 U6.4(A4)
FPGAI_TCK: J5.6 R124.1 U27.3(2A)
FPGAI_TDI: J5.10 R5.1 U6.1(A1)
FPGAI_TDO: J5.8 R122.2
FPGAI_TMS: J5.4 R123.2 U27.1(1A)
IL07.LR.G3.S_N: sheet FPGA0B/LR_G3_S_N
IL07.LR.G3.S_P: sheet FPGA0B/LR_G3_S_P
IL07.LR.VTT: C19.2 C20.2
IL07.VIOLR: C15.2 C16.2 C17.2 C18.2 ; sheet FPGA7B/VCCIO, port IL07.VIOLR
IL07.VIOTB: C46.2 C47.2 C48.2 C49.2 ; sheet FPGA0B/VCCIO, port IL07.VIOTB
IL12.LR.G3.S_N: sheet FPGA1B/LR_G3_S_N
IL12.LR.G3.S_P: sheet FPGA1B/LR_G3_S_P
IL12.LR.VTT: C8.2 C58.2 C59.2 R8.1 R9.1
IL12.VIOLR: C54.2 C55.2 C56.2 C57.2 ; sheet FPGA2B/VCCIO, port IL12.VIOLR
IL12.VIOTB: C50.2 C51.2 C52.2 C53.2 ; sheet FPGA1B/VCCIO, port IL12.VIOTB
IL34.LR.VTT: C26.2 C27.2
IL34.TB.G13.C_N: sheet FPGA3B/TB_G13_C_N
IL34.TB.G13.C_P: sheet FPGA3B/TB_G13_C_P
IL34.VIOLR: C22.2 C23.2 C24.2 C25.2 ; sheet FPGA3B/VCCIO, port IL34.VIOLR
IL34.VIOTB: C28.2 C29.2 C30.2 ; sheet FPGA4B/VCCIO, port IL34.VIOTB
IL68.LR.VTT: C37.2 C38.2
IL68.VIOLR: C33.2 C34.2 C35.2 C36.2 ; sheet FPGA6B/VCCIO, port IL68.VIOLR
IL68.VIOTB: C31.2 C32.2 R4.2 U6.13(VCCB) ; sheet FPGA8B/VCCIO, port IL68.VIOTB
JTAGI.TCK: J5.5  [also labelled JTAGO.TCK]
JTAGI.TDI: J5.9
JTAGI.TMS: J5.3  [also labelled JTAGO.TMS]
JTAGO.TDI: J5.7
NetD1_2: D1.2(K) Q1.3(C)
NetQ1_2: Q1.2(E) R7.1
NetR29_2: R29.2 U27.4(2Y)
NetR30_2: R30.2 U27.6(1Y)
NetR122_1: R122.1 U6.2(A2)

### Channels
MAIN/ARRAY/FPGA30: designators end in A
MAIN/ARRAY/FPGA31: designators end in B
MAIN/ARRAY/FPGA32: designators end in C
MAIN/ARRAY/FPGA33: designators end in D
MAIN/ARRAY/FPGA20: designators end in E
MAIN/ARRAY/FPGA21: designators end in F
MAIN/ARRAY/FPGA22: designators end in G
MAIN/ARRAY/FPGA23: designators end in H

### Buses and harness runs
harness CLK = port CLK
harness CLK_R = sheet FPGA1B/CLK_R
harness I2C = port I2C = sheet FPGAPOWER/I2C
harness IL07 = port IL07
harness IL12 = port IL12
harness IL34 = port IL34
harness IL68 = port IL68
harness JTAGI = port JTAGI
harness JTAGO = port JTAGO
harness port MIB = sheet FPGA0B/MIB

### Notes on the sheet
- EXCEPTION #1 !
- BANK 7 DOES NOT HAVE ENOUGH PINS
- SO WE CONNECT 2 PINS TO BANK 0
- BANK 2 DOES NOT HAVE ENOUGH PINS
- SO WE CONNECT 2 PINS TO BANK 1
- EXCEPTION #2 !
- BANK 4 DOES NOT HAVE CLOCK INPUT SO
- WE CONNECT BANK 4 CLOCK TO BANK 3
- EXCEPTION #3 !
- (near F1) 200mA RESETTABLE
- (near U27) BUFFER
- (near J5) JUMPER INSERTED = Enable fpga-to-fpga JTAG daisy-chain
- (near J5) JUMPER REMOVED = Disable fpga-to-fpga JTAG daisy-chain
- (near U6) LEVEL TRANSLATOR
- Red
- PLACE NEXT TO BANK 3
- PLACE NEXT TO BANK 4
- PLACE NEXT TO BANK 6
- PLACE NEXT TO BANK 8
- PLACE NEXT TO BANK 7
- PLACE NEXT TO BANK 0
- PLACE NEXT TO BANK 1
- PLACE NEXT TO BANK 2
- Title
- Engineer
- Revision
- Drawn By
- Checked By
- Date
- Sheet
- of

### Library data of the parts
C6-C8 C16-C18 C20 C21 C23-C25 C27 C29 C30 C32 C34-C36 C38 C47-C49 C51-C53 C55-C57 C59 = CAP: Ceramic Capacitor 100nF ±10% 50V X7R 0402; Manufacturer: Murata; Tr: -55:125; Manufacturer P/N: GCM155R71H104KE02; Tolerance: ±10%; Voltage: 50V; Footprint: *; Package: 0402
C15 C19 C22 C26 C28 C31 C33 C37 C46 C50 C54 C58 = CAP: Ceramic Capacitor 2.2uF ±20% 10V X7R 0603; Manufacturer: TDK; Tr: -55:125; Manufacturer P/N: C1608X7R1A225M080; Tolerance: ±20%; Voltage: 10V; Footprint: *; Package: 0603
D1 = LED0603RD: LED, SMT 0603, Color Red, 5mA, 1.85V; Manufacturer: Panasonic; Manufacturer P/N: LNJ237W82RA; Package: 0603 Polarized
F1 = 0ZCJ0020FF2E: as F4 on sheet main; Manufacturer P/N: 0ZCJ0020FF2E; Package: 1206
J5 = GRPB052VWVN: Male Header, 0.050" Pitch, 2x5 Position, Right Angle; Manufacturer: Sullins; Manufacturer P/N: GRPB052MWCN
Q1 = MMBT4401-7-F: NPN Small Signal Transistor SMD SOT-23; Manufacturer: Diodes, Inc.; Manufacturer P/N: MMBT4401-7-F
R4 R5 = RES: as R29 on sheet main; Tolerance: ±1%; Manufacturer P/N: ERJ-2RKF4701X; Alternatives: *; Footprint: *; Package: 0402
R7 = RES: Thick Film Resistor 240 ±1% 0.1W 75V 0402; Manufacturer: Panasonic; Tcr: ±100; Tr: -55:155; Voltage: 75; Power: 0.1; Tolerance: ±1%; Manufacturer P/N: ERJ-2RKF2400X; Alternatives: *; Footprint: *; Package: 0402
R8 R9 = RES: Thick Film Resistor 49.9 ±1% 0.1W 50V 0402; Manufacturer: Panasonic; Tcr: ±100; Tr: -55:155; Voltage: 50; Power: 0.1; Tolerance: ±1%; Manufacturer P/N: ERJ-2RKF49R9X; Alternatives: *; Footprint: *; Package: 0402
R29 R30 R122 = RES: Thick Film Resistor 20 ±1% 0.1W 75V 0402; Manufacturer: Panasonic; Tcr: ±100; Tr: -55:155; Voltage: 75; Power: 0.1; Tolerance: ±1%; Manufacturer P/N: ERJ-2RKF20R0X; Alternatives: *; Footprint: *; Package: 0402
R123 R124 = RES: Thick Film Resistor 1M ±1% 0.1W 75V 0402; Manufacturer: Panasonic; Tcr: ±100; Tr: -55:155; Voltage: 75; Power: 0.1; Tolerance: ±1%; Manufacturer P/N: ERJ-2RKF1004X; Alternatives: *; Footprint: *; Package: 0402
U6 = SN74AVC4T774RSVR: 4-Bit Dual-Supply Bus Transceiver; Manufacturer: Texas Instruments; Manufacturer P/N: SN74AVC4T774RSVR
U27 = SN74LVC2G17DCK: Dual Schmitt-Trigger Buffer; Manufacturer: Texas Instruments; Manufacturer P/N: SN74LVC2G17DCK

## Sheet fpga-bank0.SchDoc: CS - FPGA - Bank 0
size Letter; CheckedBy: J. Brinton; CompanyName: Signal Laboratories, Inc.; DrawnBy: J. Brinton; Engineer: J. Brinton; Address1: 3479 Edison Way; Address2: Menlo Park CA 94025; Address3: +1 (877) 778-8435; Address4: siglabs.com; Revision: 3; SheetNumber: 5; SheetTotal: 47
Used 8 times, as channels MAIN/ARRAY/FPGA30/FPGA0B, MAIN/ARRAY/FPGA31/FPGA0B, MAIN/ARRAY/FPGA32/FPGA0B, MAIN/ARRAY/FPGA33/FPGA0B, MAIN/ARRAY/FPGA20/FPGA0B, MAIN/ARRAY/FPGA21/FPGA0B, MAIN/ARRAY/FPGA22/FPGA0B, MAIN/ARRAY/FPGA23/FPGA0B. Parts and nets are listed once, with the designators drawn on the sheet.
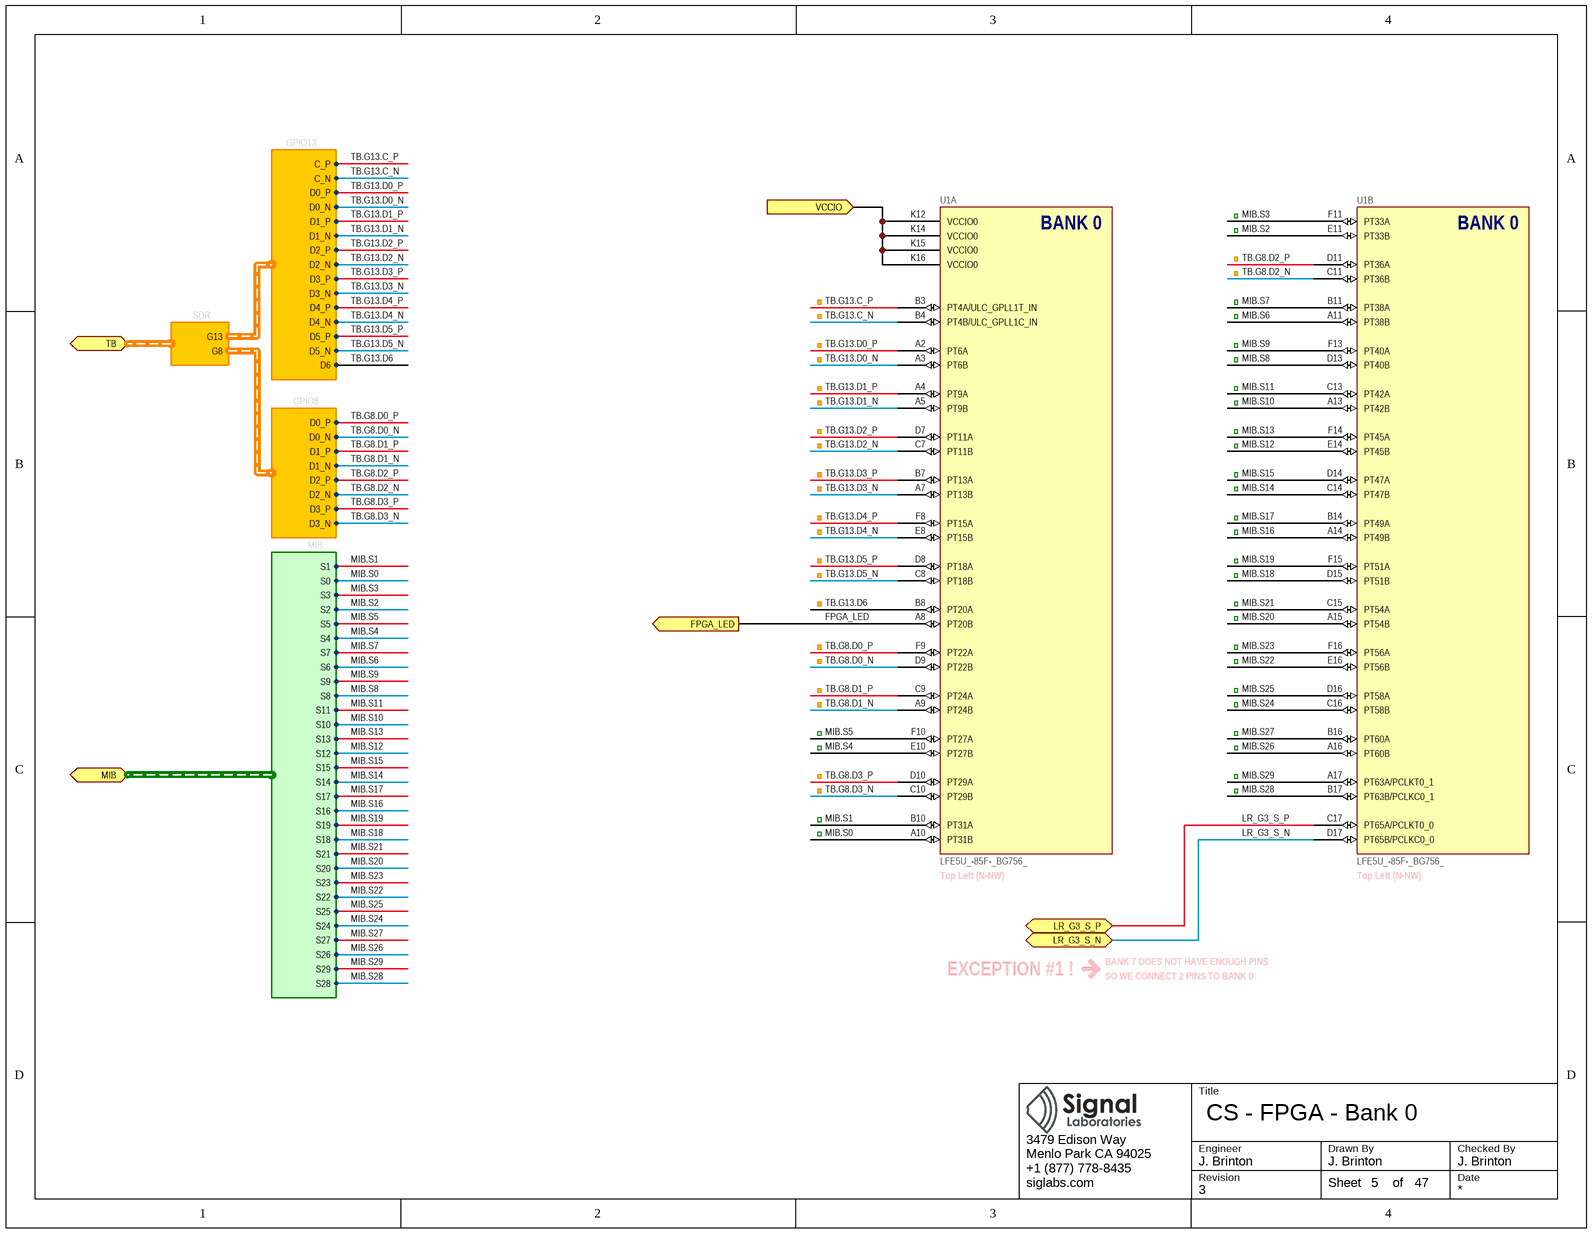
[diagram p4: fpga-bank0.SchDoc]

### Parts
U1  LFE5U_-85F-_BG756_  [caBGA756]  (parts A,B of 19)

### Ports
FPGA_LED (out), LR_G3_S_N, LR_G3_S_P, MIB (harness MIB), TB (harness SDR), VCCIO (in)

### Harnesses
MIB: S1, S0, S3, S2, S5, S4, S7, S6, S9, S8, S11, S10, S13, S12, S15, S14, S17, S16, S19, S18, S21, S20, S23, S22, S25, S24, S27, S26, S29, S28
GPIO8: D0_P, D0_N, D1_P, D1_N, D2_P, D2_N, D3_P, D3_N
SDR: G13, G8
GPIO13: C_P, C_N, D0_P, D0_N, D1_P, D1_N, D2_P, D2_N, D3_P, D3_N, D4_P, D4_N, D5_P, D5_N, D6

### Nets
FPGA_LED: U1.A8(PT20B) ; port FPGA_LED
LR_G3_S_N: U1.D17(PT65B/PCLKC0_0) ; port LR_G3_S_N
LR_G3_S_P: U1.C17(PT65A/PCLKT0_0) ; port LR_G3_S_P
MIB.S0: U1.A10(PT31B) ; port MIB.S0
MIB.S1: U1.B10(PT31A) ; port MIB.S1
MIB.S2: U1.E11(PT33B) ; port MIB.S2
MIB.S3: U1.F11(PT33A) ; port MIB.S3
MIB.S4: U1.E10(PT27B) ; port MIB.S4
MIB.S5: U1.F10(PT27A) ; port MIB.S5
MIB.S6: U1.A11(PT38B) ; port MIB.S6
MIB.S7: U1.B11(PT38A) ; port MIB.S7
MIB.S8: U1.D13(PT40B) ; port MIB.S8
MIB.S9: U1.F13(PT40A) ; port MIB.S9
MIB.S10: U1.A13(PT42B) ; port MIB.S10
MIB.S11: U1.C13(PT42A) ; port MIB.S11
MIB.S12: U1.E14(PT45B) ; port MIB.S12
MIB.S13: U1.F14(PT45A) ; port MIB.S13
MIB.S14: U1.C14(PT47B) ; port MIB.S14
MIB.S15: U1.D14(PT47A) ; port MIB.S15
MIB.S16: U1.A14(PT49B) ; port MIB.S16
MIB.S17: U1.B14(PT49A) ; port MIB.S17
MIB.S18: U1.D15(PT51B) ; port MIB.S18
MIB.S19: U1.F15(PT51A) ; port MIB.S19
MIB.S20: U1.A15(PT54B) ; port MIB.S20
MIB.S21: U1.C15(PT54A) ; port MIB.S21
MIB.S22: U1.E16(PT56B) ; port MIB.S22
MIB.S23: U1.F16(PT56A) ; port MIB.S23
MIB.S24: U1.C16(PT58B) ; port MIB.S24
MIB.S25: U1.D16(PT58A) ; port MIB.S25
MIB.S26: U1.A16(PT60B) ; port MIB.S26
MIB.S27: U1.B16(PT60A) ; port MIB.S27
MIB.S28: U1.B17(PT63B/PCLKC0_1) ; port MIB.S28
MIB.S29: U1.A17(PT63A/PCLKT0_1) ; port MIB.S29
TB.G8.D0_N: U1.D9(PT22B) ; harness GPIO8.D0_N
TB.G8.D0_P: U1.F9(PT22A) ; harness GPIO8.D0_P
TB.G8.D1_N: U1.A9(PT24B) ; harness GPIO8.D1_N
TB.G8.D1_P: U1.C9(PT24A) ; harness GPIO8.D1_P
TB.G8.D2_N: U1.C11(PT36B) ; harness GPIO8.D2_N
TB.G8.D2_P: U1.D11(PT36A) ; harness GPIO8.D2_P
TB.G8.D3_N: U1.C10(PT29B) ; harness GPIO8.D3_N
TB.G8.D3_P: U1.D10(PT29A) ; harness GPIO8.D3_P
TB.G13.C_N: U1.B4(PT4B/ULC_GPLL1C_IN) ; harness GPIO13.C_N
TB.G13.C_P: U1.B3(PT4A/ULC_GPLL1T_IN) ; harness GPIO13.C_P
TB.G13.D0_N: U1.A3(PT6B) ; harness GPIO13.D0_N
TB.G13.D0_P: U1.A2(PT6A) ; harness GPIO13.D0_P
TB.G13.D1_N: U1.A5(PT9B) ; harness GPIO13.D1_N
TB.G13.D1_P: U1.A4(PT9A) ; harness GPIO13.D1_P
TB.G13.D2_N: U1.C7(PT11B) ; harness GPIO13.D2_N
TB.G13.D2_P: U1.D7(PT11A) ; harness GPIO13.D2_P
TB.G13.D3_N: U1.A7(PT13B) ; harness GPIO13.D3_N
TB.G13.D3_P: U1.B7(PT13A) ; harness GPIO13.D3_P
TB.G13.D4_N: U1.E8(PT15B) ; harness GPIO13.D4_N
TB.G13.D4_P: U1.F8(PT15A) ; harness GPIO13.D4_P
TB.G13.D5_N: U1.C8(PT18B) ; harness GPIO13.D5_N
TB.G13.D5_P: U1.D8(PT18A) ; harness GPIO13.D5_P
TB.G13.D6: U1.B8(PT20A) ; harness GPIO13.D6
VCCIO: U1.K12(VCCIO0) U1.K14(VCCIO0) U1.K15(VCCIO0) U1.K16(VCCIO0) ; port VCCIO

### Channels
MAIN/ARRAY/FPGA30/FPGA0B: designators end in A#1; ports FPGA_LED=FPGA_LED_FPGA30 LR_G3_S_N=IL07.LR.G3.S_N_FPGA30 LR_G3_S_P=IL07.LR.G3.S_P_FPGA30 VCCIO=B.VIOTB_FPGA30
MAIN/ARRAY/FPGA31/FPGA0B: designators end in B#1; ports FPGA_LED=FPGA_LED_FPGA31 LR_G3_S_N=IL07.LR.G3.S_N_FPGA31 LR_G3_S_P=IL07.LR.G3.S_P_FPGA31 VCCIO=B.VIOTB_FPGA31
MAIN/ARRAY/FPGA32/FPGA0B: designators end in C#1; ports FPGA_LED=FPGA_LED_FPGA32 LR_G3_S_N=IL07.LR.G3.S_N_FPGA32 LR_G3_S_P=IL07.LR.G3.S_P_FPGA32 VCCIO=B.VIOTB_FPGA32
MAIN/ARRAY/FPGA33/FPGA0B: designators end in D#1; ports FPGA_LED=FPGA_LED_FPGA33 LR_G3_S_N=IL07.LR.G3.S_N_FPGA33 LR_G3_S_P=IL07.LR.G3.S_P_FPGA33 VCCIO=B.VIOTB_FPGA33
MAIN/ARRAY/FPGA20/FPGA0B: designators end in E#1; ports FPGA_LED=FPGA_LED_FPGA20 LR_G3_S_N=IL07.LR.G3.S_N_FPGA20 LR_G3_S_P=IL07.LR.G3.S_P_FPGA20 VCCIO=IL07.VIOTB_FPGA20
MAIN/ARRAY/FPGA21/FPGA0B: designators end in F#1; ports FPGA_LED=FPGA_LED_FPGA21 LR_G3_S_N=IL07.LR.G3.S_N_FPGA21 LR_G3_S_P=IL07.LR.G3.S_P_FPGA21 VCCIO=IL07.VIOTB_FPGA21
MAIN/ARRAY/FPGA22/FPGA0B: designators end in G#1; ports FPGA_LED=FPGA_LED_FPGA22 LR_G3_S_N=IL07.LR.G3.S_N_FPGA22 LR_G3_S_P=IL07.LR.G3.S_P_FPGA22 VCCIO=IL07.VIOTB_FPGA22
MAIN/ARRAY/FPGA23/FPGA0B: designators end in H#1; ports FPGA_LED=FPGA_LED_FPGA23 LR_G3_S_N=IL07.LR.G3.S_N_FPGA23 LR_G3_S_P=IL07.LR.G3.S_P_FPGA23 VCCIO=IL07.VIOTB_FPGA23

### Notes on the sheet
- (near U1) Top Left (N-NW)
- EXCEPTION #1 !
- BANK 7 DOES NOT HAVE ENOUGH PINS
- SO WE CONNECT 2 PINS TO BANK 0
- Title
- Engineer
- Revision
- Drawn By
- Checked By
- Date
- Sheet
- of
- (in symbol LFE5U_-85F-_BG756_, part A) BANK 0
- (in symbol LFE5U_-85F-_BG756_, part B) BANK 0

### Library data of the parts
U1 = LFE5U_-85F-_BG756_: ECP5 FPGA, 85k LUT, 756-caBGA; Manufacturer: Lattice Semiconductor; Manufacturer P/N: LFE5U_-85F-_BG756_

## Sheet fpga-bank1.SchDoc: CS - FPGA - Bank 1
size Letter; CheckedBy: J. Brinton; CompanyName: Signal Laboratories, Inc.; DrawnBy: J. Brinton; Engineer: J. Brinton; Address1: 3479 Edison Way; Address2: Menlo Park CA 94025; Address3: +1 (877) 778-8435; Address4: siglabs.com; Revision: 3; SheetNumber: 6; SheetTotal: 47
Used 8 times, as channels MAIN/ARRAY/FPGA30/FPGA1B, MAIN/ARRAY/FPGA31/FPGA1B, MAIN/ARRAY/FPGA32/FPGA1B, MAIN/ARRAY/FPGA33/FPGA1B, MAIN/ARRAY/FPGA20/FPGA1B, MAIN/ARRAY/FPGA21/FPGA1B, MAIN/ARRAY/FPGA22/FPGA1B, MAIN/ARRAY/FPGA23/FPGA1B. Parts and nets are listed once, with the designators drawn on the sheet.
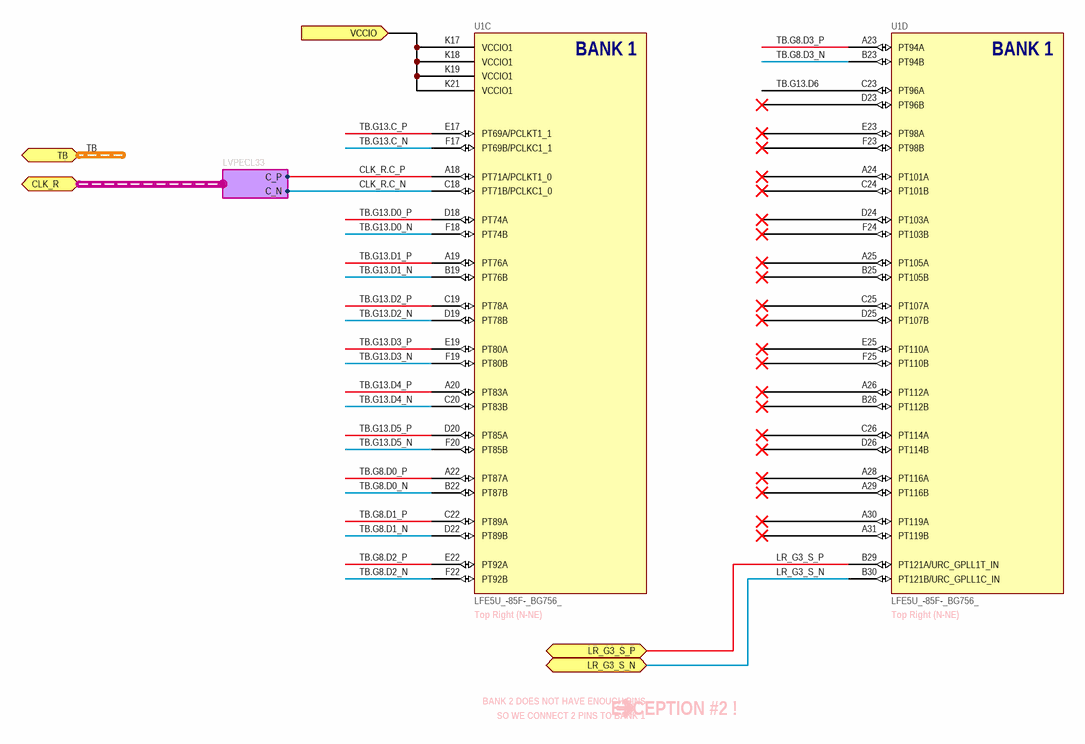
[diagram p5: fpga-bank1.SchDoc]

### Parts
U1  LFE5U_-85F-_BG756_  [caBGA756]  (parts C,D of 19)

### Ports
CLK_R (harness LVPECL33), LR_G3_S_N, LR_G3_S_P, TB (harness SDR), VCCIO (in)

### Harnesses
LVPECL33: C_P, C_N

### Nets
CLK_R.C_N: U1.C18(PT71B/PCLKC1_0) ; port CLK_R.C_N
CLK_R.C_P: U1.A18(PT71A/PCLKT1_0) ; port CLK_R.C_P
LR_G3_S_N: U1.B30(PT121B/URC_GPLL1C_IN) ; port LR_G3_S_N
LR_G3_S_P: U1.B29(PT121A/URC_GPLL1T_IN) ; port LR_G3_S_P
TB.G8.D0_N: U1.B22(PT87B)
TB.G8.D0_P: U1.A22(PT87A)
TB.G8.D1_N: U1.D22(PT89B)
TB.G8.D1_P: U1.C22(PT89A)
TB.G8.D2_N: U1.F22(PT92B)
TB.G8.D2_P: U1.E22(PT92A)
TB.G8.D3_N: U1.B23(PT94B)
TB.G8.D3_P: U1.A23(PT94A)
TB.G13.C_N: U1.F17(PT69B/PCLKC1_1)
TB.G13.C_P: U1.E17(PT69A/PCLKT1_1)
TB.G13.D0_N: U1.F18(PT74B)
TB.G13.D0_P: U1.D18(PT74A)
TB.G13.D1_N: U1.B19(PT76B)
TB.G13.D1_P: U1.A19(PT76A)
TB.G13.D2_N: U1.D19(PT78B)
TB.G13.D2_P: U1.C19(PT78A)
TB.G13.D3_N: U1.F19(PT80B)
TB.G13.D3_P: U1.E19(PT80A)
TB.G13.D4_N: U1.C20(PT83B)
TB.G13.D4_P: U1.A20(PT83A)
TB.G13.D5_N: U1.F20(PT85B)
TB.G13.D5_P: U1.D20(PT85A)
TB.G13.D6: U1.C23(PT96A)
VCCIO: U1.K17(VCCIO1) U1.K18(VCCIO1) U1.K19(VCCIO1) U1.K21(VCCIO1) ; port VCCIO

Not connected (* = marked no-connect by the designer): U1 A24(PT101A)* A25(PT105A)* A26(PT112A)* A28(PT116A)* A29(PT116B)* A30(PT119A)* A31(PT119B)* B25(PT105B)* B26(PT112B)* C24(PT101B)* C25(PT107A)* C26(PT114A)* D23(PT96B)* D24(PT103A)* D25(PT107B)* D26(PT114B)* E23(PT98A)* E25(PT110A)* F23(PT98B)* F24(PT103B)* F25(PT110B)*

### Channels
MAIN/ARRAY/FPGA30/FPGA1B: designators end in A#2; ports LR_G3_S_N=IL12.LR.G3.S_N_FPGA30 LR_G3_S_P=IL12.LR.G3.S_P_FPGA30 VCCIO=A.VIOTB_FPGA30
MAIN/ARRAY/FPGA31/FPGA1B: designators end in B#2; ports LR_G3_S_N=IL12.LR.G3.S_N_FPGA31 LR_G3_S_P=IL12.LR.G3.S_P_FPGA31 VCCIO=A.VIOTB_FPGA31
MAIN/ARRAY/FPGA32/FPGA1B: designators end in C#2; ports LR_G3_S_N=IL12.LR.G3.S_N_FPGA32 LR_G3_S_P=IL12.LR.G3.S_P_FPGA32 VCCIO=A.VIOTB_FPGA32
MAIN/ARRAY/FPGA33/FPGA1B: designators end in D#2; ports LR_G3_S_N=IL12.LR.G3.S_N_FPGA33 LR_G3_S_P=IL12.LR.G3.S_P_FPGA33 VCCIO=IL12.VIOTB_FPGA33
MAIN/ARRAY/FPGA20/FPGA1B: designators end in E#2; ports LR_G3_S_N=IL12.LR.G3.S_N_FPGA20 LR_G3_S_P=IL12.LR.G3.S_P_FPGA20 VCCIO=A.VIOTB_FPGA20
MAIN/ARRAY/FPGA21/FPGA1B: designators end in F#2; ports LR_G3_S_N=IL12.LR.G3.S_N_FPGA21 LR_G3_S_P=IL12.LR.G3.S_P_FPGA21 VCCIO=A.VIOTB_FPGA21
MAIN/ARRAY/FPGA22/FPGA1B: designators end in G#2; ports LR_G3_S_N=IL12.LR.G3.S_N_FPGA22 LR_G3_S_P=IL12.LR.G3.S_P_FPGA22 VCCIO=A.VIOTB_FPGA22
MAIN/ARRAY/FPGA23/FPGA1B: designators end in H#2; ports LR_G3_S_N=IL12.LR.G3.S_N_FPGA23 LR_G3_S_P=IL12.LR.G3.S_P_FPGA23 VCCIO=IL12.VIOTB_FPGA23

### Buses and harness runs
harness TB = port TB

### Notes on the sheet
- (near U1) Top Right (N-NE)
- EXCEPTION #2 !
- BANK 2 DOES NOT HAVE ENOUGH PINS
- SO WE CONNECT 2 PINS TO BANK 1
- Title
- Engineer
- Revision
- Drawn By
- Checked By
- Date
- Sheet
- of
- (in symbol LFE5U_-85F-_BG756_, part C) BANK 1
- (in symbol LFE5U_-85F-_BG756_, part D) BANK 1

### Library data of the parts
U1 = LFE5U_-85F-_BG756_: as U1 on sheet fpga-bank0; Manufacturer P/N: LFE5U_-85F-_BG756_

## Sheet fpga-bank2.SchDoc: CS - FPGA - Bank 2
size Letter; CheckedBy: J. Brinton; CompanyName: Signal Laboratories, Inc.; DrawnBy: J. Brinton; Engineer: J. Brinton; Address1: 3479 Edison Way; Address2: Menlo Park CA 94025; Address3: +1 (877) 778-8435; Address4: siglabs.com; Revision: 3; SheetNumber: 7; SheetTotal: 47
Used 8 times, as channels MAIN/ARRAY/FPGA30/FPGA2B, MAIN/ARRAY/FPGA31/FPGA2B, MAIN/ARRAY/FPGA32/FPGA2B, MAIN/ARRAY/FPGA33/FPGA2B, MAIN/ARRAY/FPGA20/FPGA2B, MAIN/ARRAY/FPGA21/FPGA2B, MAIN/ARRAY/FPGA22/FPGA2B, MAIN/ARRAY/FPGA23/FPGA2B. Parts and nets are listed once, with the designators drawn on the sheet.
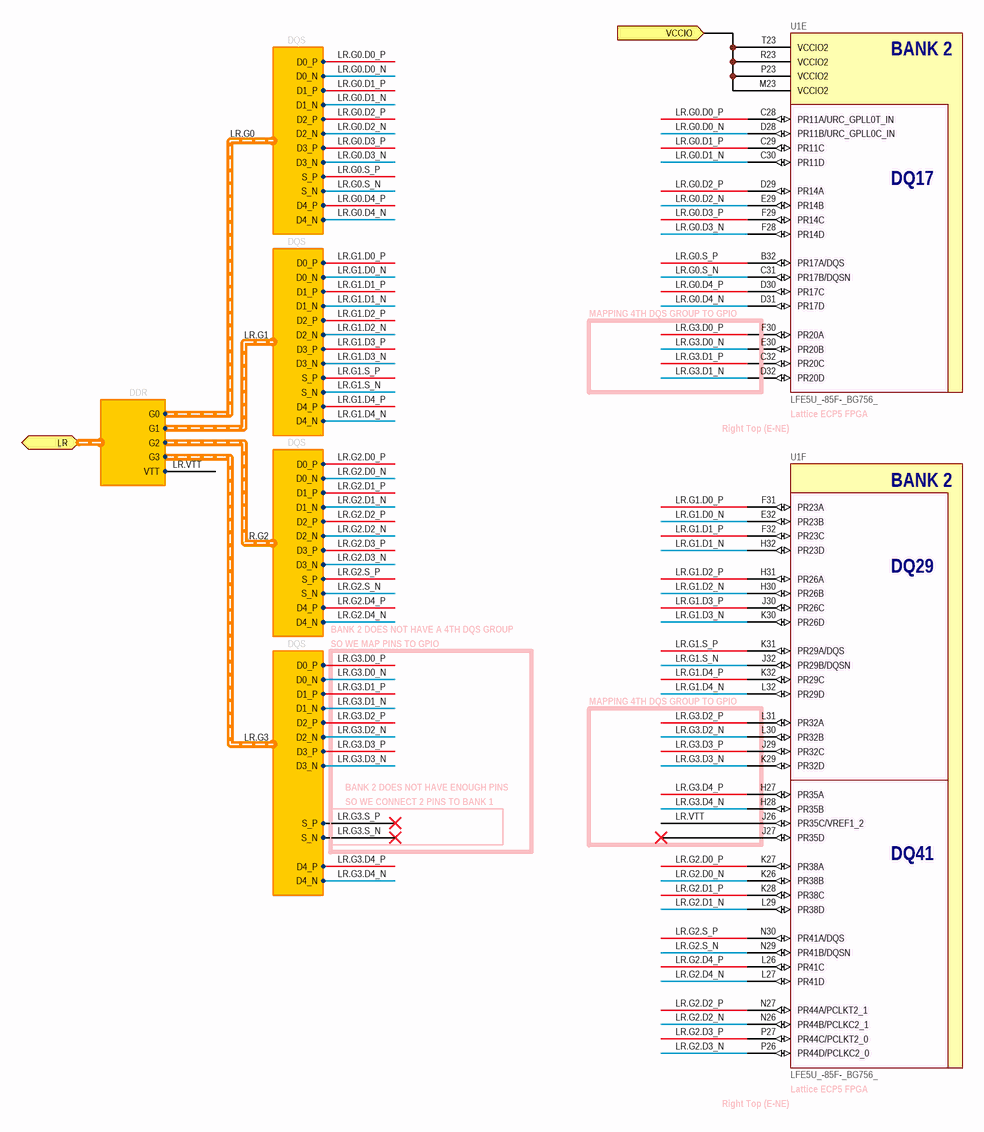
[diagram p6: fpga-bank2.SchDoc]

### Parts
U1  LFE5U_-85F-_BG756_  [caBGA756]  (parts E,F of 19)

### Ports
LR (harness DDR), VCCIO (in)

### Harnesses
DQS: D0_P, D0_N, D1_P, D1_N, D2_P, D2_N, D3_P, D3_N, D4_P, D4_N, S_P, S_N
DDR: G0, G1, G2, G3, VTT

### Nets
LR.G0.D0_N: U1.D28(PR11B/URC_GPLL0C_IN) ; harness DQS.D0_N
LR.G0.D0_P: U1.C28(PR11A/URC_GPLL0T_IN) ; harness DQS.D0_P
LR.G0.D1_N: U1.C30(PR11D) ; harness DQS.D1_N
LR.G0.D1_P: U1.C29(PR11C) ; harness DQS.D1_P
LR.G0.D2_N: U1.E29(PR14B) ; harness DQS.D2_N
LR.G0.D2_P: U1.D29(PR14A) ; harness DQS.D2_P
LR.G0.D3_N: U1.F28(PR14D) ; harness DQS.D3_N
LR.G0.D3_P: U1.F29(PR14C) ; harness DQS.D3_P
LR.G0.D4_N: U1.D31(PR17D) ; harness DQS.D4_N
LR.G0.D4_P: U1.D30(PR17C) ; harness DQS.D4_P
LR.G0.S_N: U1.C31(PR17B/DQSN) ; harness DQS.S_N
LR.G0.S_P: U1.B32(PR17A/DQS) ; harness DQS.S_P
LR.G1.D0_N: U1.E32(PR23B) ; harness DQS.D0_N
LR.G1.D0_P: U1.F31(PR23A) ; harness DQS.D0_P
LR.G1.D1_N: U1.H32(PR23D) ; harness DQS.D1_N
LR.G1.D1_P: U1.F32(PR23C) ; harness DQS.D1_P
LR.G1.D2_N: U1.H30(PR26B) ; harness DQS.D2_N
LR.G1.D2_P: U1.H31(PR26A) ; harness DQS.D2_P
LR.G1.D3_N: U1.K30(PR26D) ; harness DQS.D3_N
LR.G1.D3_P: U1.J30(PR26C) ; harness DQS.D3_P
LR.G1.D4_N: U1.L32(PR29D) ; harness DQS.D4_N
LR.G1.D4_P: U1.K32(PR29C) ; harness DQS.D4_P
LR.G1.S_N: U1.J32(PR29B/DQSN) ; harness DQS.S_N
LR.G1.S_P: U1.K31(PR29A/DQS) ; harness DQS.S_P
LR.G2.D0_N: U1.K26(PR38B) ; harness DQS.D0_N
LR.G2.D0_P: U1.K27(PR38A) ; harness DQS.D0_P
LR.G2.D1_N: U1.L29(PR38D) ; harness DQS.D1_N
LR.G2.D1_P: U1.K28(PR38C) ; harness DQS.D1_P
LR.G2.D2_N: U1.N26(PR44B/PCLKC2_1) ; harness DQS.D2_N
LR.G2.D2_P: U1.N27(PR44A/PCLKT2_1) ; harness DQS.D2_P
LR.G2.D3_N: U1.P26(PR44D/PCLKC2_0) ; harness DQS.D3_N
LR.G2.D3_P: U1.P27(PR44C/PCLKT2_0) ; harness DQS.D3_P
LR.G2.D4_N: U1.L27(PR41D) ; harness DQS.D4_N
LR.G2.D4_P: U1.L26(PR41C) ; harness DQS.D4_P
LR.G2.S_N: U1.N29(PR41B/DQSN) ; harness DQS.S_N
LR.G2.S_P: U1.N30(PR41A/DQS) ; harness DQS.S_P
LR.G3.D0_N: U1.E30(PR20B) ; harness DQS.D0_N
LR.G3.D0_P: U1.F30(PR20A) ; harness DQS.D0_P
LR.G3.D1_N: U1.D32(PR20D) ; harness DQS.D1_N
LR.G3.D1_P: U1.C32(PR20C) ; harness DQS.D1_P
LR.G3.D2_N: U1.L30(PR32B) ; harness DQS.D2_N
LR.G3.D2_P: U1.L31(PR32A) ; harness DQS.D2_P
LR.G3.D3_N: U1.K29(PR32D) ; harness DQS.D3_N
LR.G3.D3_P: U1.J29(PR32C) ; harness DQS.D3_P
LR.G3.D4_N: U1.H28(PR35B) ; harness DQS.D4_N
LR.G3.D4_P: U1.H27(PR35A) ; harness DQS.D4_P
LR.G3.S_N: harness DQS.S_N
LR.G3.S_P: harness DQS.S_P
LR.VTT: U1.J26(PR35C/VREF1_2) ; port LR.VTT
VCCIO: U1.M23(VCCIO2) U1.P23(VCCIO2) U1.R23(VCCIO2) U1.T23(VCCIO2) ; port VCCIO

Not connected (* = marked no-connect by the designer): U1 J27(PR35D)*

### Channels
MAIN/ARRAY/FPGA30/FPGA2B: designators end in A#3; ports VCCIO=A.VIOLR_FPGA30
MAIN/ARRAY/FPGA31/FPGA2B: designators end in B#3; ports VCCIO=A.VIOLR_FPGA31
MAIN/ARRAY/FPGA32/FPGA2B: designators end in C#3; ports VCCIO=A.VIOLR_FPGA32
MAIN/ARRAY/FPGA33/FPGA2B: designators end in D#3; ports VCCIO=IL12.VIOLR_FPGA33
MAIN/ARRAY/FPGA20/FPGA2B: designators end in E#3; ports VCCIO=A.VIOLR_FPGA20
MAIN/ARRAY/FPGA21/FPGA2B: designators end in F#3; ports VCCIO=A.VIOLR_FPGA21
MAIN/ARRAY/FPGA22/FPGA2B: designators end in G#3; ports VCCIO=A.VIOLR_FPGA22
MAIN/ARRAY/FPGA23/FPGA2B: designators end in H#3; ports VCCIO=IL12.VIOLR_FPGA23

### Notes on the sheet
- (near U1) MAPPING 4TH DQS GROUP TO GPIO
- (near U1) Right Top (E-NE)
- (near U1) Lattice ECP5 FPGA
- BANK 2 DOES NOT HAVE A 4TH DQS GROUP
- SO WE MAP PINS TO GPIO
- BANK 2 DOES NOT HAVE ENOUGH PINS
- SO WE CONNECT 2 PINS TO BANK 1
- Title
- Engineer
- Revision
- Drawn By
- Checked By
- Date
- Sheet
- of
- (in symbol LFE5U_-85F-_BG756_, part E) BANK 2; DQ17
- (in symbol LFE5U_-85F-_BG756_, part F) BANK 2; DQ29; DQ41

### Library data of the parts
U1 = LFE5U_-85F-_BG756_: as U1 on sheet fpga-bank0; Manufacturer P/N: LFE5U_-85F-_BG756_

## Sheet fpga-bank3.SchDoc: CS - FPGA - Bank 3
size Letter; CheckedBy: J. Brinton; CompanyName: Signal Laboratories, Inc.; DrawnBy: J. Brinton; Engineer: J. Brinton; Address1: 3479 Edison Way; Address2: Menlo Park CA 94025; Address3: +1 (877) 778-8435; Address4: siglabs.com; Revision: 3; SheetNumber: 8; SheetTotal: 47
Used 8 times, as channels MAIN/ARRAY/FPGA30/FPGA3B, MAIN/ARRAY/FPGA31/FPGA3B, MAIN/ARRAY/FPGA32/FPGA3B, MAIN/ARRAY/FPGA33/FPGA3B, MAIN/ARRAY/FPGA20/FPGA3B, MAIN/ARRAY/FPGA21/FPGA3B, MAIN/ARRAY/FPGA22/FPGA3B, MAIN/ARRAY/FPGA23/FPGA3B. Parts and nets are listed once, with the designators drawn on the sheet.
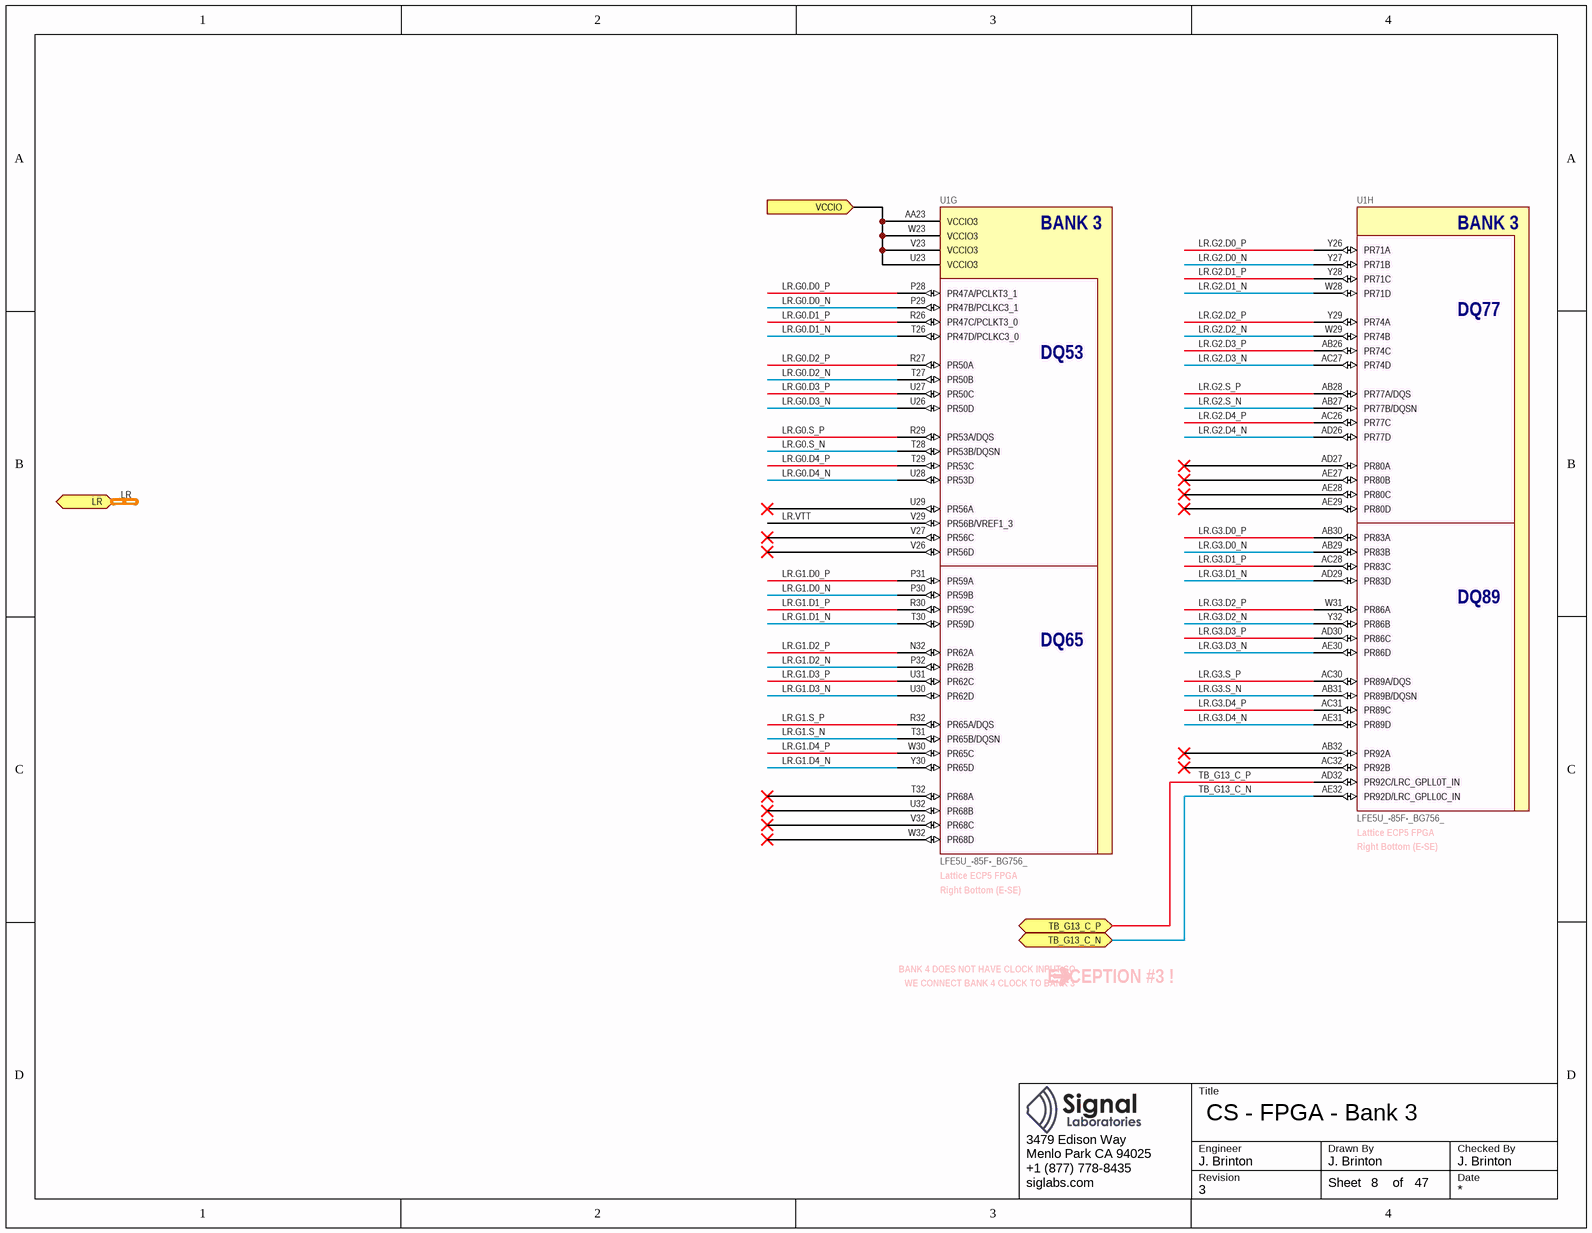
[diagram p7: fpga-bank3.SchDoc]

### Parts
U1  LFE5U_-85F-_BG756_  [caBGA756]  (parts G,H of 19)

### Ports
LR (harness DDR), TB_G13_C_N, TB_G13_C_P, VCCIO (in)

### Nets
LR.G0.D0_N: U1.P29(PR47B/PCLKC3_1)
LR.G0.D0_P: U1.P28(PR47A/PCLKT3_1)
LR.G0.D1_N: U1.T26(PR47D/PCLKC3_0)
LR.G0.D1_P: U1.R26(PR47C/PCLKT3_0)
LR.G0.D2_N: U1.T27(PR50B)
LR.G0.D2_P: U1.R27(PR50A)
LR.G0.D3_N: U1.U26(PR50D)
LR.G0.D3_P: U1.U27(PR50C)
LR.G0.D4_N: U1.U28(PR53D)
LR.G0.D4_P: U1.T29(PR53C)
LR.G0.S_N: U1.T28(PR53B/DQSN)
LR.G0.S_P: U1.R29(PR53A/DQS)
LR.G1.D0_N: U1.P30(PR59B)
LR.G1.D0_P: U1.P31(PR59A)
LR.G1.D1_N: U1.T30(PR59D)
LR.G1.D1_P: U1.R30(PR59C)
LR.G1.D2_N: U1.P32(PR62B)
LR.G1.D2_P: U1.N32(PR62A)
LR.G1.D3_N: U1.U30(PR62D)
LR.G1.D3_P: U1.U31(PR62C)
LR.G1.D4_N: U1.Y30(PR65D)
LR.G1.D4_P: U1.W30(PR65C)
LR.G1.S_N: U1.T31(PR65B/DQSN)
LR.G1.S_P: U1.R32(PR65A/DQS)
LR.G2.D0_N: U1.Y27(PR71B)
LR.G2.D0_P: U1.Y26(PR71A)
LR.G2.D1_N: U1.W28(PR71D)
LR.G2.D1_P: U1.Y28(PR71C)
LR.G2.D2_N: U1.W29(PR74B)
LR.G2.D2_P: U1.Y29(PR74A)
LR.G2.D3_N: U1.AC27(PR74D)
LR.G2.D3_P: U1.AB26(PR74C)
LR.G2.D4_N: U1.AD26(PR77D)
LR.G2.D4_P: U1.AC26(PR77C)
LR.G2.S_N: U1.AB27(PR77B/DQSN)
LR.G2.S_P: U1.AB28(PR77A/DQS)
LR.G3.D0_N: U1.AB29(PR83B)
LR.G3.D0_P: U1.AB30(PR83A)
LR.G3.D1_N: U1.AD29(PR83D)
LR.G3.D1_P: U1.AC28(PR83C)
LR.G3.D2_N: U1.Y32(PR86B)
LR.G3.D2_P: U1.W31(PR86A)
LR.G3.D3_N: U1.AE30(PR86D)
LR.G3.D3_P: U1.AD30(PR86C)
LR.G3.D4_N: U1.AE31(PR89D)
LR.G3.D4_P: U1.AC31(PR89C)
LR.G3.S_N: U1.AB31(PR89B/DQSN)
LR.G3.S_P: U1.AC30(PR89A/DQS)
LR.VTT: U1.V29(PR56B/VREF1_3)
TB_G13_C_N: U1.AE32(PR92D/LRC_GPLL0C_IN) ; port TB_G13_C_N
TB_G13_C_P: U1.AD32(PR92C/LRC_GPLL0T_IN) ; port TB_G13_C_P
VCCIO: U1.AA23(VCCIO3) U1.U23(VCCIO3) U1.V23(VCCIO3) U1.W23(VCCIO3) ; port VCCIO

Not connected (* = marked no-connect by the designer): U1 AB32(PR92A)* AC32(PR92B)* AD27(PR80A)* AE27(PR80B)* AE28(PR80C)* AE29(PR80D)* T32(PR68A)* U29(PR56A)* U32(PR68B)* V26(PR56D)* V27(PR56C)* V32(PR68C)* W32(PR68D)*

### Channels
MAIN/ARRAY/FPGA30/FPGA3B: designators end in A#4; ports TB_G13_C_N=IL34.TB.G13.C_N_FPGA30 TB_G13_C_P=IL34.TB.G13.C_P_FPGA30 VCCIO=IL34.VIOLR_FPGA30
MAIN/ARRAY/FPGA31/FPGA3B: designators end in B#4; ports TB_G13_C_N=IL34.TB.G13.C_N_FPGA31 TB_G13_C_P=IL34.TB.G13.C_P_FPGA31 VCCIO=IL34.VIOLR_FPGA31
MAIN/ARRAY/FPGA32/FPGA3B: designators end in C#4; ports TB_G13_C_N=IL34.TB.G13.C_N_FPGA32 TB_G13_C_P=IL34.TB.G13.C_P_FPGA32 VCCIO=IL34.VIOLR_FPGA32
MAIN/ARRAY/FPGA33/FPGA3B: designators end in D#4; ports TB_G13_C_N=IL34.TB.G13.C_N_FPGA33 TB_G13_C_P=IL34.TB.G13.C_P_FPGA33 VCCIO=IL34.VIOLR_FPGA33
MAIN/ARRAY/FPGA20/FPGA3B: designators end in E#4; ports TB_G13_C_N=IL34.TB.G13.C_N_FPGA20 TB_G13_C_P=IL34.TB.G13.C_P_FPGA20 VCCIO=A.VIOLR_FPGA20
MAIN/ARRAY/FPGA21/FPGA3B: designators end in F#4; ports TB_G13_C_N=IL34.TB.G13.C_N_FPGA21 TB_G13_C_P=IL34.TB.G13.C_P_FPGA21 VCCIO=A.VIOLR_FPGA21
MAIN/ARRAY/FPGA22/FPGA3B: designators end in G#4; ports TB_G13_C_N=IL34.TB.G13.C_N_FPGA22 TB_G13_C_P=IL34.TB.G13.C_P_FPGA22 VCCIO=A.VIOLR_FPGA22
MAIN/ARRAY/FPGA23/FPGA3B: designators end in H#4; ports TB_G13_C_N=IL34.TB.G13.C_N_FPGA23 TB_G13_C_P=IL34.TB.G13.C_P_FPGA23 VCCIO=A.VIOLR_FPGA23

### Buses and harness runs
harness LR = port LR

### Notes on the sheet
- (near U1) Right Bottom (E-SE)
- (near U1) Lattice ECP5 FPGA
- EXCEPTION #3 !
- BANK 4 DOES NOT HAVE CLOCK INPUT SO
- WE CONNECT BANK 4 CLOCK TO BANK 3
- Title
- Engineer
- Revision
- Drawn By
- Checked By
- Date
- Sheet
- of
- (in symbol LFE5U_-85F-_BG756_, part G) BANK 3; DQ53; DQ65
- (in symbol LFE5U_-85F-_BG756_, part H) BANK 3; DQ77; DQ89

### Library data of the parts
U1 = LFE5U_-85F-_BG756_: as U1 on sheet fpga-bank0; Manufacturer P/N: LFE5U_-85F-_BG756_